# Altium project MACHINE_EMBBED_V1I2.PrjPcb (part 2 of 3)

## Sheet [05] - PROCESSOR 2 of 3, USB and SERIAL.SchDoc
size A2; DocumentNumber: 5; SheetNumber: 5; SheetTotal: 13; NameAuthor: Angle Vu
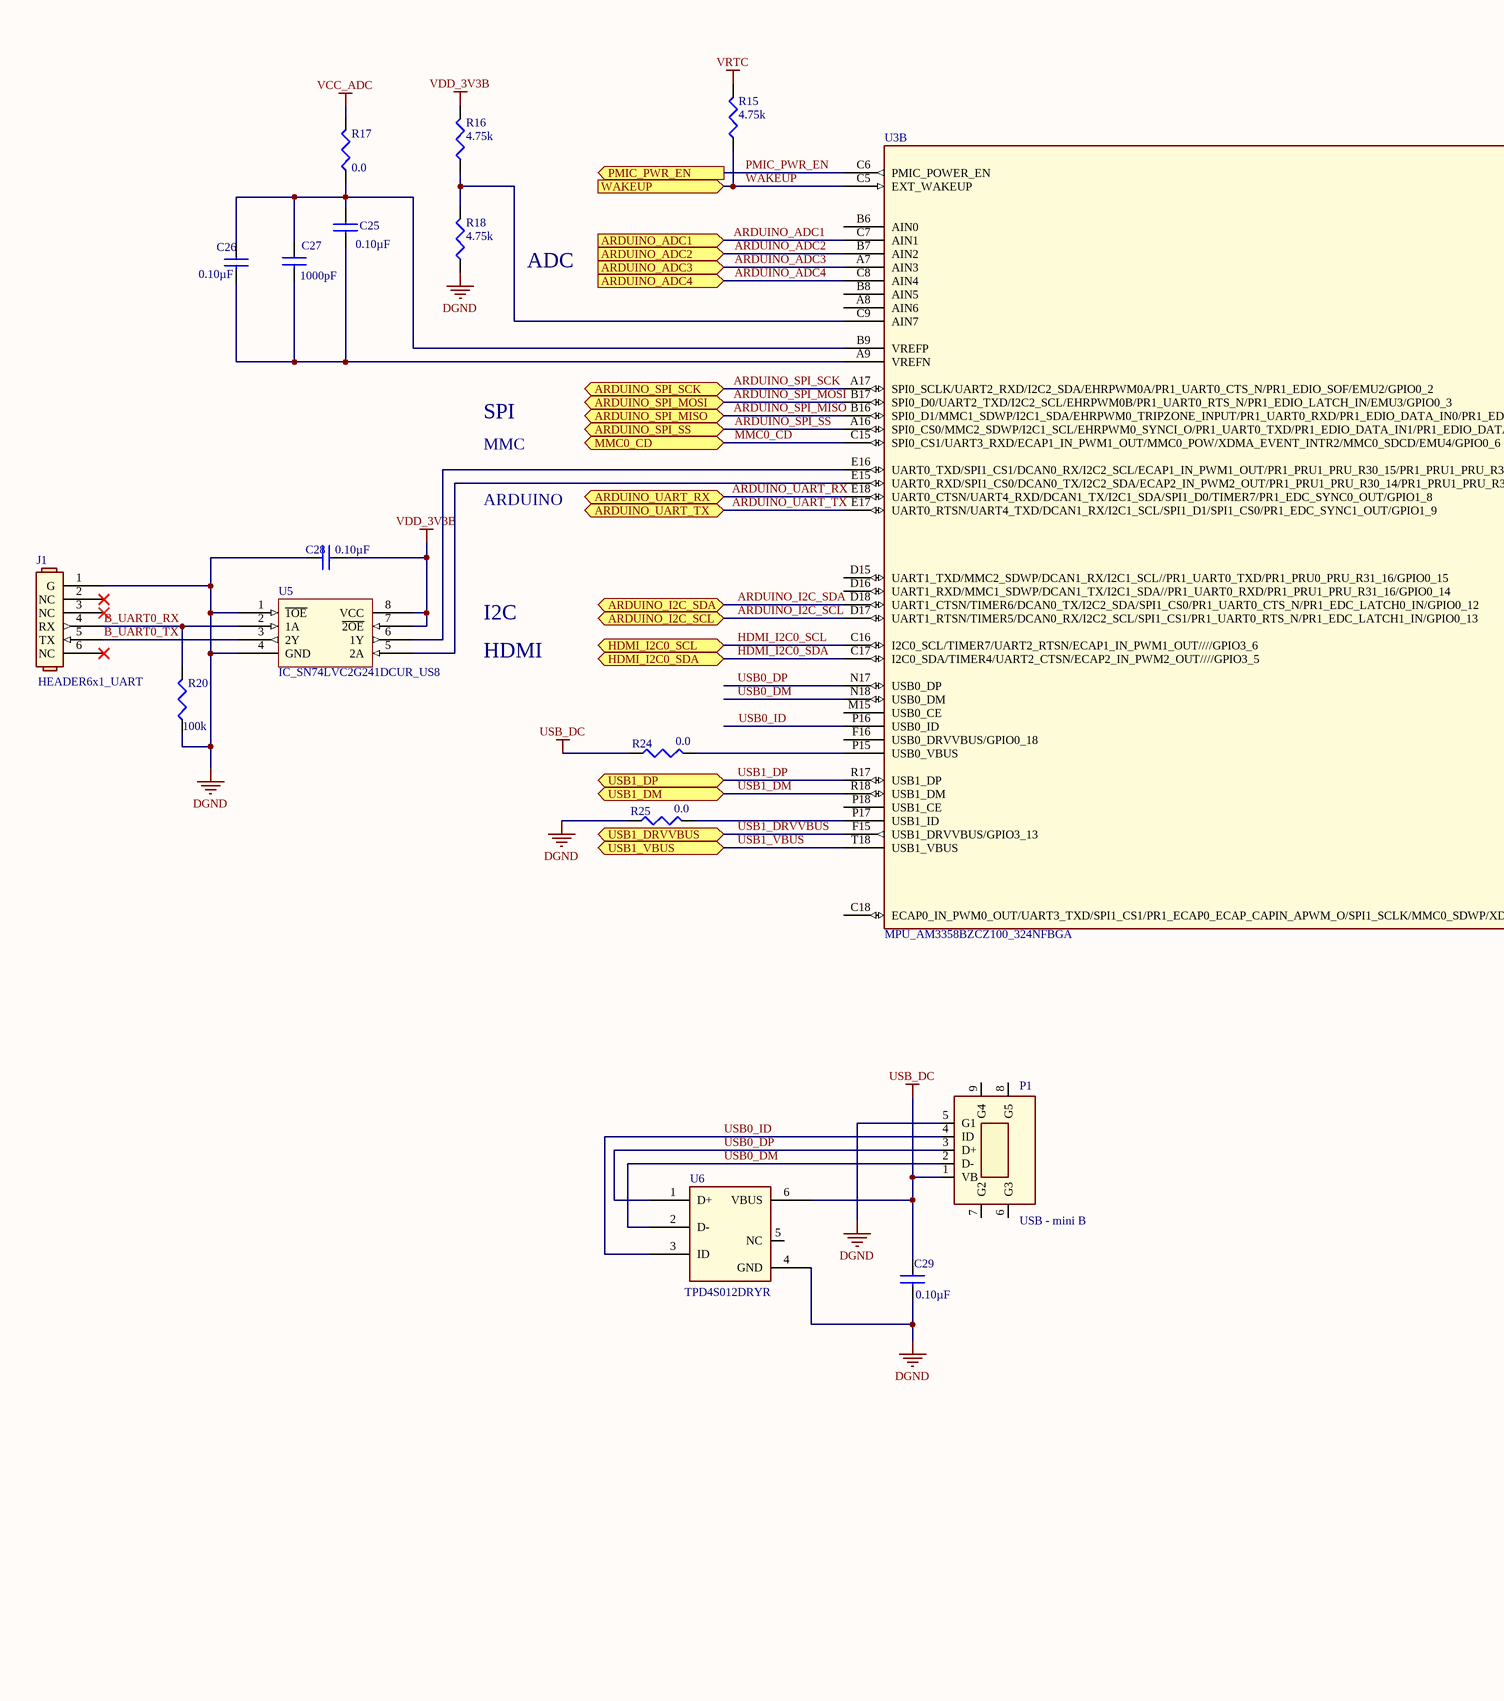
[diagram p5: [05] - PROCESSOR 2 of 3, USB and SERIAL.SchDoc, left]
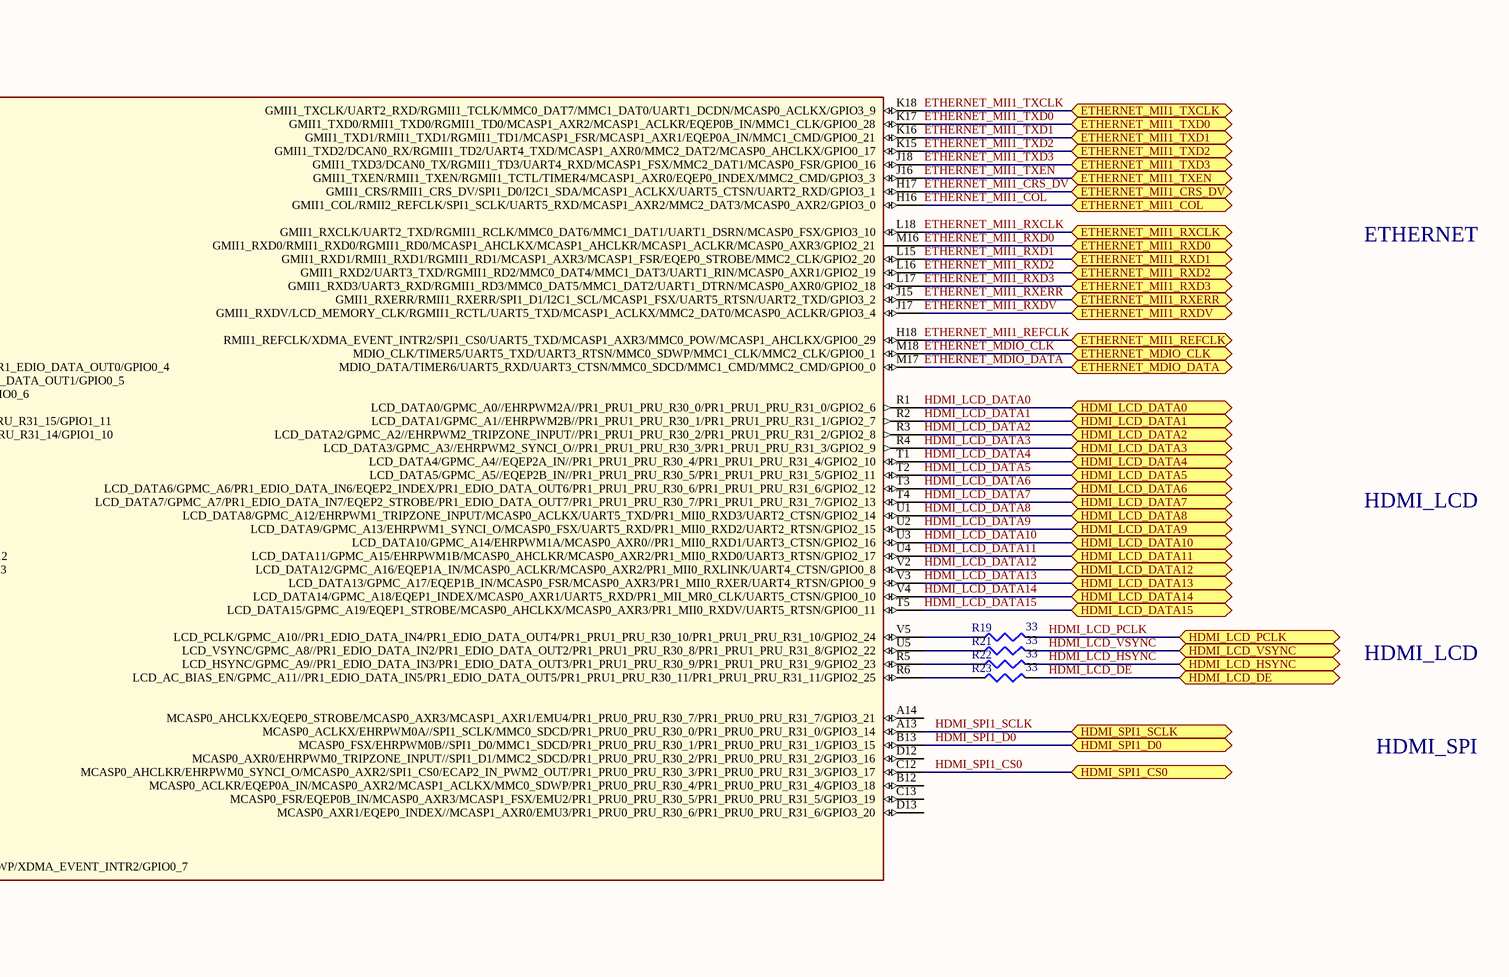
[diagram p6: [05] - PROCESSOR 2 of 3, USB and SERIAL.SchDoc, right]

### Parts
C25  Capacitance: 0.10µF  (hidden comment: C_CER_0.1uF_6.3V_X5R_0402_10%)
C26  Capacitance: 0.10µF  (hidden comment: C_CER_0.1uF_6.3V_X5R_0402_10%)
C27  Capacitance: 1000pF  (hidden comment: C_CER_1000pF_16V_X5R_0402_10%)
C28  Capacitance: 0.10µF  (hidden comment: C_CER_0.1uF_6.3V_X5R_0402_10%)
C29  Capacitance: 0.10µF  (hidden comment: C_CER_0.1uF_6.3V_X5R_0402_10%)
J1  HEADER6x1_UART
P1  Connector Type: USB - mini B  (hidden comment: PWR_MINI_USB_UX60SC-MB-5ST(80))
R15  Resistance (Ohms): 4.75k  (hidden comment: R_4.75K_1/16W_0402_1%)
R16  Resistance (Ohms): 4.75k  (hidden comment: R_4.75K_1/16W_0402_1%)
R17  Resistance (Ohms): 0.0  (hidden comment: R_0OhM_1/16W_0402)
R18  Resistance (Ohms): 4.75k  (hidden comment: R_4.75K_1/16W_0402_1%)
R19  Resistance (Ohms): 33  (hidden comment: R_33_1/16W_0402_5%)
R20  Resistance (Ohms): 100k  (hidden comment: R_100k_1/16W_0402_1%)
R21  Resistance (Ohms): 33  (hidden comment: R_33_1/16W_0402_5%)
R22  Resistance (Ohms): 33  (hidden comment: R_33_1/16W_0402_5%)
R23  Resistance (Ohms): 33  (hidden comment: R_33_1/16W_0402_5%)
R24  Resistance (Ohms): 0.0  (hidden comment: R_0OhM_1/16W_0402)
R25  Resistance (Ohms): 0.0  (hidden comment: R_0OhM_1/16W_0402)
U3  MPU_AM3358BZCZ100_324NFBGA  (part B of 3)
U5  IC_SN74LVC2G241DCUR_US8
U6  Manufacturer Part Number: TPD4S012DRYR  (hidden comment: IC_4CH_ESD_TPD4S012DRYR_6SON)

### Ports
ARDUINO_ADC1 (in), ARDUINO_ADC2 (in), ARDUINO_ADC3 (in), ARDUINO_ADC4 (in), ARDUINO_I2C_SCL (bidir), ARDUINO_I2C_SDA (bidir), ARDUINO_SPI_MISO (bidir), ARDUINO_SPI_MOSI (bidir), ARDUINO_SPI_SCK (bidir), ARDUINO_SPI_SS (bidir), ARDUINO_UART_RX (bidir), ARDUINO_UART_TX (bidir), ETHERNET_MDIO_CLK (bidir), ETHERNET_MDIO_DATA (bidir), ETHERNET_MII1_COL (bidir), ETHERNET_MII1_CRS_DV (bidir), ETHERNET_MII1_REFCLK (bidir), ETHERNET_MII1_RXCLK (bidir), ETHERNET_MII1_RXD0 (bidir), ETHERNET_MII1_RXD1 (bidir), ETHERNET_MII1_RXD2 (bidir), ETHERNET_MII1_RXD3 (bidir), ETHERNET_MII1_RXDV (bidir), ETHERNET_MII1_RXERR (bidir), ETHERNET_MII1_TXCLK (bidir), ETHERNET_MII1_TXD0 (bidir), ETHERNET_MII1_TXD1 (bidir), ETHERNET_MII1_TXD2 (bidir), ETHERNET_MII1_TXD3 (bidir), ETHERNET_MII1_TXEN (bidir), HDMI_I2C0_SCL (bidir), HDMI_I2C0_SDA (bidir), HDMI_LCD_DATA0 (bidir), HDMI_LCD_DATA1 (bidir), HDMI_LCD_DATA2 (bidir), HDMI_LCD_DATA3 (bidir), HDMI_LCD_DATA4 (bidir), HDMI_LCD_DATA5 (bidir), HDMI_LCD_DATA6 (bidir), HDMI_LCD_DATA7 (bidir), HDMI_LCD_DATA8 (bidir), HDMI_LCD_DATA9 (bidir), HDMI_LCD_DATA10 (bidir), HDMI_LCD_DATA11 (bidir), HDMI_LCD_DATA12 (bidir), HDMI_LCD_DATA13 (bidir), HDMI_LCD_DATA14 (bidir), HDMI_LCD_DATA15 (bidir), HDMI_LCD_DE (bidir), HDMI_LCD_HSYNC (bidir), HDMI_LCD_PCLK (bidir), HDMI_LCD_VSYNC (bidir), HDMI_SPI1_CS0 (bidir), HDMI_SPI1_D0 (bidir), HDMI_SPI1_SCLK (bidir), MMC0_CD (bidir), PMIC_PWR_EN (out), USB1_DM (bidir), USB1_DP (bidir), USB1_DRVVBUS (bidir), USB1_VBUS (bidir), WAKEUP (in)

### Nets
DGND: C28.1 C29.2 J1.1(G) P1.5(G1) R18.1 R20.1 R25.1 U5.1(~{1OE}) U5.4(GND) U6.4(GND)  [project net GND_OSC0]
USB_DC: C29.1 P1.1(VB) R24.1 U6.6(VBUS)
VCC_ADC: R17.2
VDD_3V3B: C28.2 R16.2 U5.7(~{2OE}) U5.8(VCC)
VRTC: R15.2
ARDUINO_ADC1: U3.C7(AIN1) ; port ARDUINO_ADC1
ARDUINO_ADC2: U3.B7(AIN2) ; port ARDUINO_ADC2
ARDUINO_ADC3: U3.A7(AIN3) ; port ARDUINO_ADC3
ARDUINO_ADC4: U3.C8(AIN4) ; port ARDUINO_ADC4
ARDUINO_I2C_SCL: U3.D17(UART1_RTSN/TIMER5/DCAN0_RX/I2C2_SCL/SPI1_CS1/PR1_UART0_RTS_N/PR1_EDC_LATCH1_IN/GPIO0_13) ; port ARDUINO_I2C_SCL
ARDUINO_I2C_SDA: U3.D18(UART1_CTSN/TIMER6/DCAN0_TX/I2C2_SDA/SPI1_CS0/PR1_UART0_CTS_N/PR1_EDC_LATCH0_IN/GPIO0_12) ; port ARDUINO_I2C_SDA
ARDUINO_SPI_MISO: U3.B16(SPI0_D1/MMC1_SDWP/I2C1_SDA/EHRPWM0_TRIPZONE_INPUT/PR1_UART0_RXD/PR1_EDIO_DATA_IN0/PR1_EDIO_DATA_OUT0/GPIO0_4) ; port ARDUINO_SPI_MISO
ARDUINO_SPI_MOSI: U3.B17(SPI0_D0/UART2_TXD/I2C2_SCL/EHRPWM0B/PR1_UART0_RTS_N/PR1_EDIO_LATCH_IN/EMU3/GPIO0_3) ; port ARDUINO_SPI_MOSI
ARDUINO_SPI_SCK: U3.A17(SPI0_SCLK/UART2_RXD/I2C2_SDA/EHRPWM0A/PR1_UART0_CTS_N/PR1_EDIO_SOF/EMU2/GPIO0_2) ; port ARDUINO_SPI_SCK
ARDUINO_SPI_SS: U3.A16(SPI0_CS0/MMC2_SDWP/I2C1_SCL/EHRPWM0_SYNCI_O/PR1_UART0_TXD/PR1_EDIO_DATA_IN1/PR1_EDIO_DATA_OUT1/GPIO0_5) ; port ARDUINO_SPI_SS
ARDUINO_UART_RX: U3.E18(UART0_CTSN/UART4_RXD/DCAN1_TX/I2C1_SDA/SPI1_D0/TIMER7/PR1_EDC_SYNC0_OUT/GPIO1_8) ; port ARDUINO_UART_RX
ARDUINO_UART_TX: U3.E17(UART0_RTSN/UART4_TXD/DCAN1_RX/I2C1_SCL/SPI1_D1/SPI1_CS0/PR1_EDC_SYNC1_OUT/GPIO1_9) ; port ARDUINO_UART_TX
B_UART0_RX: J1.4(RX) R20.2 U5.2(1A)
B_UART0_TX: J1.5(TX) U5.3(2Y)
ETHERNET_MDIO_CLK: U3.M18(MDIO_CLK/TIMER5/UART5_TXD/UART3_RTSN/MMC0_SDWP/MMC1_CLK/MMC2_CLK/GPIO0_1) ; port ETHERNET_MDIO_CLK
ETHERNET_MDIO_DATA: U3.M17(MDIO_DATA/TIMER6/UART5_RXD/UART3_CTSN/MMC0_SDCD/MMC1_CMD/MMC2_CMD/GPIO0_0) ; port ETHERNET_MDIO_DATA
ETHERNET_MII1_COL: U3.H16(GMII1_COL/RMII2_REFCLK/SPI1_SCLK/UART5_RXD/MCASP1_AXR2/MMC2_DAT3/MCASP0_AXR2/GPIO3_0) ; port ETHERNET_MII1_COL
ETHERNET_MII1_CRS_DV: U3.H17(GMII1_CRS/RMII1_CRS_DV/SPI1_D0/I2C1_SDA/MCASP1_ACLKX/UART5_CTSN/UART2_RXD/GPIO3_1) ; port ETHERNET_MII1_CRS_DV
ETHERNET_MII1_REFCLK: U3.H18(RMII1_REFCLK/XDMA_EVENT_INTR2/SPI1_CS0/UART5_TXD/MCASP1_AXR3/MMC0_POW/MCASP1_AHCLKX/GPIO0_29) ; port ETHERNET_MII1_REFCLK
ETHERNET_MII1_RXCLK: U3.L18(GMII1_RXCLK/UART2_TXD/RGMII1_RCLK/MMC0_DAT6/MMC1_DAT1/UART1_DSRN/MCASP0_FSX/GPIO3_10) ; port ETHERNET_MII1_RXCLK
ETHERNET_MII1_RXD0: U3.M16(GMII1_RXD0/RMII1_RXD0/RGMII1_RD0/MCASP1_AHCLKX/MCASP1_AHCLKR/MCASP1_ACLKR/MCASP0_AXR3/GPIO2_21) ; port ETHERNET_MII1_RXD0
ETHERNET_MII1_RXD1: U3.L15(GMII1_RXD1/RMII1_RXD1/RGMII1_RD1/MCASP1_AXR3/MCASP1_FSR/EQEP0_STROBE/MMC2_CLK/GPIO2_20) ; port ETHERNET_MII1_RXD1
ETHERNET_MII1_RXD2: U3.L16(GMII1_RXD2/UART3_TXD/RGMII1_RD2/MMC0_DAT4/MMC1_DAT3/UART1_RIN/MCASP0_AXR1/GPIO2_19) ; port ETHERNET_MII1_RXD2
ETHERNET_MII1_RXD3: U3.L17(GMII1_RXD3/UART3_RXD/RGMII1_RD3/MMC0_DAT5/MMC1_DAT2/UART1_DTRN/MCASP0_AXR0/GPIO2_18) ; port ETHERNET_MII1_RXD3
ETHERNET_MII1_RXDV: U3.J17(GMII1_RXDV/LCD_MEMORY_CLK/RGMII1_RCTL/UART5_TXD/MCASP1_ACLKX/MMC2_DAT0/MCASP0_ACLKR/GPIO3_4) ; port ETHERNET_MII1_RXDV
ETHERNET_MII1_RXERR: U3.J15(GMII1_RXERR/RMII1_RXERR/SPI1_D1/I2C1_SCL/MCASP1_FSX/UART5_RTSN/UART2_TXD/GPIO3_2) ; port ETHERNET_MII1_RXERR
ETHERNET_MII1_TXCLK: U3.K18(GMII1_TXCLK/UART2_RXD/RGMII1_TCLK/MMC0_DAT7/MMC1_DAT0/UART1_DCDN/MCASP0_ACLKX/GPIO3_9) ; port ETHERNET_MII1_TXCLK
ETHERNET_MII1_TXD0: U3.K17(GMII1_TXD0/RMII1_TXD0/RGMII1_TD0/MCASP1_AXR2/MCASP1_ACLKR/EQEP0B_IN/MMC1_CLK/GPIO0_28) ; port ETHERNET_MII1_TXD0
ETHERNET_MII1_TXD1: U3.K16(GMII1_TXD1/RMII1_TXD1/RGMII1_TD1/MCASP1_FSR/MCASP1_AXR1/EQEP0A_IN/MMC1_CMD/GPIO0_21) ; port ETHERNET_MII1_TXD1
ETHERNET_MII1_TXD2: U3.K15(GMII1_TXD2/DCAN0_RX/RGMII1_TD2/UART4_TXD/MCASP1_AXR0/MMC2_DAT2/MCASP0_AHCLKX/GPIO0_17) ; port ETHERNET_MII1_TXD2
ETHERNET_MII1_TXD3: U3.J18(GMII1_TXD3/DCAN0_TX/RGMII1_TD3/UART4_RXD/MCASP1_FSX/MMC2_DAT1/MCASP0_FSR/GPIO0_16) ; port ETHERNET_MII1_TXD3
ETHERNET_MII1_TXEN: U3.J16(GMII1_TXEN/RMII1_TXEN/RGMII1_TCTL/TIMER4/MCASP1_AXR0/EQEP0_INDEX/MMC2_CMD/GPIO3_3) ; port ETHERNET_MII1_TXEN
HDMI_I2C0_SCL: U3.C16(I2C0_SCL/TIMER7/UART2_RTSN/ECAP1_IN_PWM1_OUT////GPIO3_6) ; port HDMI_I2C0_SCL
HDMI_I2C0_SDA: U3.C17(I2C0_SDA/TIMER4/UART2_CTSN/ECAP2_IN_PWM2_OUT////GPIO3_5) ; port HDMI_I2C0_SDA
HDMI_LCD_DATA0: U3.R1(LCD_DATA0/GPMC_A0//EHRPWM2A//PR1_PRU1_PRU_R30_0/PR1_PRU1_PRU_R31_0/GPIO2_6) ; port HDMI_LCD_DATA0
HDMI_LCD_DATA1: U3.R2(LCD_DATA1/GPMC_A1//EHRPWM2B//PR1_PRU1_PRU_R30_1/PR1_PRU1_PRU_R31_1/GPIO2_7) ; port HDMI_LCD_DATA1
HDMI_LCD_DATA2: U3.R3(LCD_DATA2/GPMC_A2//EHRPWM2_TRIPZONE_INPUT//PR1_PRU1_PRU_R30_2/PR1_PRU1_PRU_R31_2/GPIO2_8) ; port HDMI_LCD_DATA2
HDMI_LCD_DATA3: U3.R4(LCD_DATA3/GPMC_A3//EHRPWM2_SYNCI_O//PR1_PRU1_PRU_R30_3/PR1_PRU1_PRU_R31_3/GPIO2_9) ; port HDMI_LCD_DATA3
HDMI_LCD_DATA4: U3.T1(LCD_DATA4/GPMC_A4//EQEP2A_IN//PR1_PRU1_PRU_R30_4/PR1_PRU1_PRU_R31_4/GPIO2_10) ; port HDMI_LCD_DATA4
HDMI_LCD_DATA5: U3.T2(LCD_DATA5/GPMC_A5//EQEP2B_IN//PR1_PRU1_PRU_R30_5/PR1_PRU1_PRU_R31_5/GPIO2_11) ; port HDMI_LCD_DATA5
HDMI_LCD_DATA6: U3.T3(LCD_DATA6/GPMC_A6/PR1_EDIO_DATA_IN6/EQEP2_INDEX/PR1_EDIO_DATA_OUT6/PR1_PRU1_PRU_R30_6/PR1_PRU1_PRU_R31_6/GPIO2_12) ; port HDMI_LCD_DATA6
HDMI_LCD_DATA7: U3.T4(LCD_DATA7/GPMC_A7/PR1_EDIO_DATA_IN7/EQEP2_STROBE/PR1_EDIO_DATA_OUT7/PR1_PRU1_PRU_R30_7/PR1_PRU1_PRU_R31_7/GPIO2_13) ; port HDMI_LCD_DATA7
HDMI_LCD_DATA8: U3.U1(LCD_DATA8/GPMC_A12/EHRPWM1_TRIPZONE_INPUT/MCASP0_ACLKX/UART5_TXD/PR1_MII0_RXD3/UART2_CTSN/GPIO2_14) ; port HDMI_LCD_DATA8
HDMI_LCD_DATA9: U3.U2(LCD_DATA9/GPMC_A13/EHRPWM1_SYNCI_O/MCASP0_FSX/UART5_RXD/PR1_MII0_RXD2/UART2_RTSN/GPIO2_15) ; port HDMI_LCD_DATA9
HDMI_LCD_DATA10: U3.U3(LCD_DATA10/GPMC_A14/EHRPWM1A/MCASP0_AXR0//PR1_MII0_RXD1/UART3_CTSN/GPIO2_16) ; port HDMI_LCD_DATA10
HDMI_LCD_DATA11: U3.U4(LCD_DATA11/GPMC_A15/EHRPWM1B/MCASP0_AHCLKR/MCASP0_AXR2/PR1_MII0_RXD0/UART3_RTSN/GPIO2_17) ; port HDMI_LCD_DATA11
HDMI_LCD_DATA12: U3.V2(LCD_DATA12/GPMC_A16/EQEP1A_IN/MCASP0_ACLKR/MCASP0_AXR2/PR1_MII0_RXLINK/UART4_CTSN/GPIO0_8) ; port HDMI_LCD_DATA12
HDMI_LCD_DATA13: U3.V3(LCD_DATA13/GPMC_A17/EQEP1B_IN/MCASP0_FSR/MCASP0_AXR3/PR1_MII0_RXER/UART4_RTSN/GPIO0_9) ; port HDMI_LCD_DATA13
HDMI_LCD_DATA14: U3.V4(LCD_DATA14/GPMC_A18/EQEP1_INDEX/MCASP0_AXR1/UART5_RXD/PR1_MII_MR0_CLK/UART5_CTSN/GPIO0_10) ; port HDMI_LCD_DATA14
HDMI_LCD_DATA15: U3.T5(LCD_DATA15/GPMC_A19/EQEP1_STROBE/MCASP0_AHCLKX/MCASP0_AXR3/PR1_MII0_RXDV/UART5_RTSN/GPIO0_11) ; port HDMI_LCD_DATA15
HDMI_LCD_DE: R23.2 ; port HDMI_LCD_DE
HDMI_LCD_HSYNC: R22.2 ; port HDMI_LCD_HSYNC
HDMI_LCD_PCLK: R19.2 ; port HDMI_LCD_PCLK
HDMI_LCD_VSYNC: R21.2 ; port HDMI_LCD_VSYNC
HDMI_SPI1_CS0: U3.C12(MCASP0_AHCLKR/EHRPWM0_SYNCI_O/MCASP0_AXR2/SPI1_CS0/ECAP2_IN_PWM2_OUT/PR1_PRU0_PRU_R30_3/PR1_PRU0_PRU_R31_3/GPIO3_17) ; port HDMI_SPI1_CS0
HDMI_SPI1_D0: U3.B13(MCASP0_FSX/EHRPWM0B//SPI1_D0/MMC1_SDCD/PR1_PRU0_PRU_R30_1/PR1_PRU0_PRU_R31_1/GPIO3_15) ; port HDMI_SPI1_D0
HDMI_SPI1_SCLK: U3.A13(MCASP0_ACLKX/EHRPWM0A//SPI1_SCLK/MMC0_SDCD/PR1_PRU0_PRU_R30_0/PR1_PRU0_PRU_R31_0/GPIO3_14) ; port HDMI_SPI1_SCLK
MMC0_CD: U3.C15(SPI0_CS1/UART3_RXD/ECAP1_IN_PWM1_OUT/MMC0_POW/XDMA_EVENT_INTR2/MMC0_SDCD/EMU4/GPIO0_6) ; port MMC0_CD
PMIC_PWR_EN: U3.C6(PMIC_POWER_EN) ; port PMIC_PWR_EN
USB0_DM: P1.2(D-) U3.N18(USB0_DM) U6.2(D-)
USB0_DP: P1.3(D+) U3.N17(USB0_DP) U6.1(D+)
USB0_ID: P1.4(ID) U3.P16(USB0_ID) U6.3(ID)
USB1_DM: U3.R18(USB1_DM) ; port USB1_DM
USB1_DP: U3.R17(USB1_DP) ; port USB1_DP
USB1_DRVVBUS: U3.F15(USB1_DRVVBUS/GPIO3_13) ; port USB1_DRVVBUS
USB1_VBUS: U3.T18(USB1_VBUS) ; port USB1_VBUS
WAKEUP: R15.1 U3.C5(EXT_WAKEUP) ; port WAKEUP
NetC25_1: C25.1 C26.1 C27.1 R17.1 U3.B9(VREFP)
NetC25_2: C25.2 C26.2 C27.2 U3.A9(VREFN)
NetR16_1: R16.1 R18.2 U3.C9(AIN7)
NetR19_1: R19.1 U3.V5(LCD_PCLK/GPMC_A10//PR1_EDIO_DATA_IN4/PR1_EDIO_DATA_OUT4/PR1_PRU1_PRU_R30_10/PR1_PRU1_PRU_R31_10/GPIO2_24)
NetR21_1: R21.1 U3.U5(LCD_VSYNC/GPMC_A8//PR1_EDIO_DATA_IN2/PR1_EDIO_DATA_OUT2/PR1_PRU1_PRU_R30_8/PR1_PRU1_PRU_R31_8/GPIO2_22)
NetR22_1: R22.1 U3.R5(LCD_HSYNC/GPMC_A9//PR1_EDIO_DATA_IN3/PR1_EDIO_DATA_OUT3/PR1_PRU1_PRU_R30_9/PR1_PRU1_PRU_R31_9/GPIO2_23)
NetR23_1: R23.1 U3.R6(LCD_AC_BIAS_EN/GPMC_A11//PR1_EDIO_DATA_IN5/PR1_EDIO_DATA_OUT5/PR1_PRU1_PRU_R30_11/PR1_PRU1_PRU_R31_11/GPIO2_25)
NetR24_2: R24.2 U3.P15(USB0_VBUS)
NetR25_2: R25.2 U3.P17(USB1_ID)
NetU3_E15: U3.E15(UART0_RXD/SPI1_CS0/DCAN0_TX/I2C2_SDA/ECAP2_IN_PWM2_OUT/PR1_PRU1_PRU_R30_14/PR1_PRU1_PRU_R31_14/GPIO1_10) U5.5(2A)
NetU3_E16: U3.E16(UART0_TXD/SPI1_CS1/DCAN0_RX/I2C2_SCL/ECAP1_IN_PWM1_OUT/PR1_PRU1_PRU_R30_15/PR1_PRU1_PRU_R31_15/GPIO1_11) U5.6(1Y)

Not connected (* = marked no-connect by the designer): J1 2(NC)* 3(NC)* 6(NC)*; P1 6(G3) 7(G2) 8(G5) 9(G4); U3 A8(AIN6) A14(MCASP0_AHCLKX/EQEP0_STROBE/MCASP0_AXR3/MCASP1_AXR1/EMU4/PR1_PRU0_PRU_R30_7/PR1_PRU0_PRU_R31_7/GPIO3_21) B6(AIN0) B8(AIN5) B12(MCASP0_ACLKR/EQEP0A_IN/MCASP0_AXR2/MCASP1_ACLKX/MMC0_SDWP/PR1_PRU0_PRU_R30_4/PR1_PRU0_PRU_R31_4/GPIO3_18) C13(MCASP0_FSR/EQEP0B_IN/MCASP0_AXR3/MCASP1_FSX/EMU2/PR1_PRU0_PRU_R30_5/PR1_PRU0_PRU_R31_5/GPIO3_19) C18(ECAP0_IN_PWM0_OUT/UART3_TXD/SPI1_CS1/PR1_ECAP0_ECAP_CAPIN_APWM_O/SPI1_SCLK/MMC0_SDWP/XDMA_EVENT_INTR2/GPIO0_7) D12(MCASP0_AXR0/EHRPWM0_TRIPZONE_INPUT//SPI1_D1/MMC2_SDCD/PR1_PRU0_PRU_R30_2/PR1_PRU0_PRU_R31_2/GPIO3_16) D13(MCASP0_AXR1/EQEP0_INDEX//MCASP1_AXR0/EMU3/PR1_PRU0_PRU_R30_6/PR1_PRU0_PRU_R31_6/GPIO3_20) D15(UART1_TXD/MMC2_SDWP/DCAN1_RX/I2C1_SCL//PR1_UART0_TXD/PR1_PRU0_PRU_R31_16/GPIO0_15) D16(UART1_RXD/MMC1_SDWP/DCAN1_TX/I2C1_SDA//PR1_UART0_RXD/PR1_PRU1_PRU_R31_16/GPIO0_14) F16(USB0_DRVVBUS/GPIO0_18) M15(USB0_CE) P18(USB1_CE); U6 5(NC)

### Notes on the sheet
- ADC
- ETHERNET
- SPI
- MMC
- ARDUINO
- HDMI_LCD
- I2C
- HDMI
- HDMI_SPI
- CLOCKS (CPU & PCIE)
- Designed By
- Checked By
- Page Name:
- Size:
- A2
- Company:
- Address:
- Sheet:
- /
- (in symbol BeagleBoard_org) Title; Size; Document Number; Rev; Date:; Sheet; of
- (in symbol CONN_54819-0578_2) VBUS; SHIELD; D-; D+; GND

### Library data of the parts
C25 C26 C28 C29 = C_CER_0.1uF_6.3V_X5R_0402_10%: CAP CER 0.1UF 6.3V X5R 0402; Manufacturer: Murata Electronics North America; Manufacturer Part Number: GRM155R60J104KA01D; Tolerance: ±10%; Supplier 1: Digi-Key; RoHS: RoHS Compliant; Category: Capacitors; Stock 1: 370000; Pricing 1: 10000=0.0021, 20000=0.002, 30000=0.0019, 50000=0.0017, 100000=0.00138 (USD); Packaging: Tape & Reel (TR); Part Status: Active; Voltage - Rated: 6.3V; Temperature Coefficient: X5R; Operating Temperature: -55°C ~ 85°C; Features: -; Ratings: -; Applications: General Purpose; Failure Rate: *; Mounting Type: Surface Mount, MLCC; Package / Case: 0402 (1005 Metric); Size / Dimension: 0.039" L x 0.020" W (1.00mm x 0.50mm); Height - Seated (Max): -; Thickness (Max): 0.022" (0.55mm); Lead Spacing: -; Lead Style: -; ComponentLink1URL: http://www.murata.com/~/media/webrenewal/support/library/catalog/products/capacitor/mlcc/c02e.pdf; ComponentLink1Description: http://www.murata.com/~/media/webrenewal/support/library/catalog/products/capacitor/mlcc/c02e.pdf; Supplier Part Number 1: 490-6287-2-ND
C27 = C_CER_1000pF_16V_X5R_0402_10%: CAP CER 1000PF 16V X5R 0402; Manufacturer: Murata Electronics North America; Manufacturer Part Number: GRM155R61C102KA01D; Tolerance: ±10%; Supplier 1: Digi-Key; RoHS: RoHS Compliant; Category: Capacitors; Stock 1: 39732; Pricing 1: 1=0.1, 10=0.023, 50=0.0124, 100=0.0105, 250=0.00856, 500=0.00732, 1000=0.0057, 5000=0.00475 (USD); Packaging: Cut Tape (CT); Part Status: Active; Voltage - Rated: 16V; Temperature Coefficient: X5R; Operating Temperature: -55°C ~ 85°C; Features: -; Ratings: -; Applications: General Purpose; Failure Rate: *; Mounting Type: Surface Mount, MLCC; Package / Case: 0402 (1005 Metric); Size / Dimension: 0.039" L x 0.020" W (1.00mm x 0.50mm); Height - Seated (Max): -; Thickness (Max): 0.022" (0.55mm); Lead Spacing: -; Lead Style: *; ComponentLink1URL: http://www.murata.com/~/media/webrenewal/support/library/catalog/products/capacitor/mlcc/c02e.pdf; ComponentLink1Description: http://www.murata.com/~/media/webrenewal/support/library/catalog/products/capacitor/mlcc/c02e.pdf; Supplier Part Number 1: 490-6308-1-ND
J1 = HEADER6x1_MALE_HOLE100: CONN HEADER 6POS .100 STR TIN; Manufacturer: Amphenol FCI; Manufacturer Part Number: 68000-406HLF; Connector Type: Header, Unshrouded; Number of Positions: 6; Number of Positions Loaded: All; Pitch: 0.100" (2.54mm); Supplier 1: Digi-Key; RoHS: RoHS Compliant; Category: Connectors, Interconnects; Stock 1: 39050; Pricing 1: 1=0.25, 10=0.233, 25=0.1988, 100=0.1615, 250=0.14284, 500=0.13662, 1000=0.11178, 2500=0.10246, 5000=0.09936 (USD); Packaging: Bulk; Part Status: Active; Contact Type: Male Pin; Number of Rows: 1; Row Spacing: -; Contact Mating Length: 0.230" (5.84mm); Mounting Type: Through Hole; Termination: Solder; Fastening Type: -; Features: -; Contact Finish: Tin; Contact Finish Thickness: 100µin (2.54µm); Color: Black; ComponentLink1URL: http://portal.fciconnect.com/Comergent//fci/drawing/68000.pdf; ComponentLink1Description: http://portal.fciconnect.com/Comergent//fci/drawing/68000.pdf; Supplier Part Number 1: 609-3263-ND
P1 = PWR_MINI_USB_UX60SC-MB-5ST(80): CONN RCPT USB MINI B R/A SMD; Manufacturer: Hirose Electric Co Ltd; Number of Contacts: 5; Gender: Receptacle; Specifications: USB 2.0; Supplier 1: Digi-Key; Manufacturer Part Number: UX60SC-MB-5ST(80); RoHS: RoHS Compliant; Category: Connectors, Interconnects; Stock 1: 33000; Pricing 1: 1500=0.375, 3000=0.3625, 7500=0.35, 10500=0.3325, 15000=0.325 (USD); Packaging: Tape & Reel (TR); Part Status: Active; Mounting Type: Surface Mount, Right Angle, Horizontal; Features: Solder Retention; Ingress Protection: -; ComponentLink1URL: http://media.digikey.com/pdf/Data%20Sheets/Hirose%20PDFs/UX60S.pdf; ComponentLink1Description: http://media.digikey.com/pdf/Data%20Sheets/Hirose%20PDFs/UX60S.pdf; Supplier Part Number 1: H11671TR-ND
R15 R16 R18 = R_4.75K_1/16W_0402_1%: RES SMD 4.75K OHM 1% 1/16W 0402; Manufacturer: Vishay Dale; Manufacturer Part Number: CRCW04024K75FKED; Power (Watts): 0.063W, 1/16W; Temperature Coefficient: ±100ppm/°C; Supplier 1: Digi-Key; RoHS: RoHS Compliant; Category: Resistors; Stock 1: 360000; Pricing 1: 10000=0.0033, 30000=0.0029, 50000=0.00266, 100000=0.00261 (USD); Packaging: Tape & Reel (TR); Part Status: Active; Tolerance: ±1%; Composition: Thick Film; Features: Automotive AEC-Q200; Operating Temperature: -55°C ~ 155°C; Package / Case: 0402 (1005 Metric); Supplier Device Package: 0402; Size / Dimension: 0.039" L x 0.020" W (1.00mm x 0.50mm); Height: 0.016" (0.40mm); Number of Terminations: 2; Failure Rate: -; ComponentLink1URL: http://www.vishay.com/docs/20035/dcrcwe3.pdf; ComponentLink1Description: http://www.vishay.com/docs/20035/dcrcwe3.pdf; Supplier Part Number 1: 541-4.75KLTR-ND
R17 R24 R25 = R_0OhM_1/16W_0402: RES SMD 0.0OHM JUMPER 1/16W 0402; Manufacturer: Yageo; Manufacturer Part Number: RC0402JR-070RL; Power (Watts): 0.063W, 1/16W; Supplier 1: Digi-Key; RoHS: RoHS Compliant; Category: Resistors; Stock 1: 13978228; Pricing 1: 1=0.1, 10=0.013, 25=0.0092, 100=0.0053, 250=0.004, 500=0.0032, 1000=0.00236, 2500=0.00205, 5000=0.00169 (USD); Packaging: Cut Tape (CT); Part Status: Active; Tolerance: Jumper; Composition: Thick Film; Features: Moisture Resistant; Temperature Coefficient: -; Operating Temperature: -55°C ~ 155°C; Package / Case: 0402 (1005 Metric); Supplier Device Package: 0402; Size / Dimension: 0.039" L x 0.020" W (1.00mm x 0.50mm); Height: 0.016" (0.40mm); Number of Terminations: 2; Failure Rate: -; ComponentLink1URL: http://www.yageo.com/documents/recent/PYu-RC_Group_51_RoHS_L_04.pdf; ComponentLink1Description: http://www.yageo.com/documents/recent/PYu-RC_Group_51_RoHS_L_04.pdf; Supplier Part Number 1: 311-0.0JRCT-ND
R19 R21-R23 = R_33_1/16W_0402_5%: RES SMD 33 OHM 5% 1/16W 0402; Manufacturer: Yageo; Manufacturer Part Number: RC0402JR-0733RL; Power (Watts): 0.063W, 1/16W; Temperature Coefficient: ±100ppm/°C; Supplier 1: Digi-Key; RoHS: RoHS Compliant; Category: Resistors; Stock 1: 1941028; Pricing 1: 1=0.1, 10=0.012, 25=0.0084, 100=0.0047, 250=0.0036, 500=0.0029, 1000=0.00213, 2500=0.00185, 5000=0.00153 (USD); Packaging: Cut Tape (CT); Part Status: Active; Tolerance: ±5%; Composition: Thick Film; Features: Moisture Resistant; Operating Temperature: -55°C ~ 155°C; Package / Case: 0402 (1005 Metric); Supplier Device Package: 0402; Size / Dimension: 0.039" L x 0.020" W (1.00mm x 0.50mm); Height: 0.016" (0.40mm); Number of Terminations: 2; Failure Rate: -; ComponentLink1URL: http://www.yageo.com/documents/recent/PYu-RC_Group_51_RoHS_L_04.pdf; ComponentLink1Description: http://www.yageo.com/documents/recent/PYu-RC_Group_51_RoHS_L_04.pdf; Supplier Part Number 1: 311-33JRCT-ND
R20 = R_100k_1/16W_0402_1%: RES SMD 100K OHM 1% 1/16W 0402; Manufacturer: Vishay Dale; Manufacturer Part Number: CRCW0402100KFKED; Power (Watts): 0.063W, 1/16W; Temperature Coefficient: ±100ppm/°C; Supplier 1: Digi-Key; RoHS: RoHS Compliant; Category: Resistors; Stock 1: 1287000; Pricing 1: 10000=0.0033, 30000=0.0029, 50000=0.00266, 100000=0.00261 (USD); Packaging: Tape & Reel (TR); Part Status: Active; Tolerance: ±1%; Composition: Thick Film; Features: Automotive AEC-Q200; Operating Temperature: -55°C ~ 155°C; Package / Case: 0402 (1005 Metric); Supplier Device Package: 0402; Size / Dimension: 0.039" L x 0.020" W (1.00mm x 0.50mm); Height: 0.016" (0.40mm); Number of Terminations: 2; Failure Rate: -; ComponentLink1URL: http://www.vishay.com/docs/20035/dcrcwe3.pdf; ComponentLink1Description: http://www.vishay.com/docs/20035/dcrcwe3.pdf; Supplier Part Number 1: 541-100KLTR-ND
U3 = MPU_AM3358BZCZ100_324NFBGA: IC MPU SITARA 1.0GHZ 324NFBGA; Manufacturer: Texas Instruments; Core Processor: ARM® Cortex®-A8; Number of Cores/Bus Width: 1 Core, 32-Bit; Co-Processors/DSP: Multimedia; NEON™ SIMD; RAM Controllers: LPDDR, DDR2, DDR3, DDR3L; Graphics Acceleration: Yes; Display & Interface Controllers: LCD, Touchscreen; Ethernet: 10/100/1000 Mbps (2); USB: USB 2.0 + PHY (2); Voltage - I/O: 1.8V, 3.3V; Security Features: Cryptography, Random Number Generator; Additional Interfaces: CAN, I²C, McASP, McSPI, MMC/SD/SDIO, UART; Supplier 1: Digi-Key; Manufacturer Part Number: AM3358BZCZ100; RoHS: RoHS Compliant; Category: Integrated Circuits (ICs); Stock 1: 6211; Pricing 1: 1=19.56, 10=17.978, 100=15.1835, 500=13.50676, 1000=12.38895, 2500=11.9232, 5000=11.64375 (USD); Packaging: Tube; Part Status: Active; Speed: 1.0GHz; SATA: -; Operating Temperature: 0°C ~ 90°C (TJ); Package / Case: 324-LFBGA; Supplier Device Package: 324-NFBGA(15x15); ComponentLink1URL: http://www.ti.com/lit/ds/symlink/am3352.pdf; ComponentLink1Description: http://www.ti.com/lit/ds/symlink/am3352.pdf; Supplier Part Number 1: 296-35869-5-ND
U5 = IC_SN74LVC2G241DCUR_US8: IC BUFF/DVR TRI-ST DL US8; Manufacturer: Texas Instruments; Logic Type: Buffer, Non-Inverting; Number of Elements: 2; Number of Bits per Element: 1; Output Type: Push-Pull; Current - Output High, Low: 32mA, 32mA; Voltage - Supply: 1.65 V ~ 5.5 V; Supplier 1: Digi-Key; Manufacturer Part Number: SN74LVC2G241DCUR; RoHS: RoHS Compliant; Category: Integrated Circuits (ICs); Stock 1: 30000; Pricing 1: 3000=0.2015, 6000=0.1885, 15000=0.1755, 30000=0.1664, 75000=0.1625 (USD); Packaging: Tape & Reel (TR); Part Status: Active; Input Type: -; Operating Temperature: -40°C ~ 125°C (TA); Mounting Type: Surface Mount; Package / Case: 8-VFSOP (0.091", 2.30mm Width); Supplier Device Package: US8; ComponentLink1URL: http://www.ti.com/lit/ds/symlink/sn74lvc2g241.pdf; ComponentLink1Description: http://www.ti.com/lit/ds/symlink/sn74lvc2g241.pdf; Supplier Part Number 1: 296-11936-2-ND
U6 = IC_4CH_ESD_TPD4S012DRYR_6SON: IC 4CH ESD SOLUTION W/CLAMP 6SON; Manufacturer: Texas Instruments; Power (Watts): 60W; Number of Circuits: 4; Supplier 1: Digi-Key; RoHS: RoHS Compliant; Category: Circuit Protection; Stock 1: 35000; Pricing 1: 5000=0.23625 (USD); Packaging: Tape & Reel (TR); Part Status: Active; Voltage - Working: -; Voltage - Clamping: -; Technology: Mixed Technology; Applications: USB; Package / Case: 6-UFDFN; Supplier Device Package: 6-SON (1.45x1); ComponentLink1URL: http://www.ti.com/lit/ds/symlink/tpd4s012.pdf; ComponentLink1Description: http://www.ti.com/lit/ds/symlink/tpd4s012.pdf; Supplier Part Number 1: 296-24244-2-ND

## Sheet [06] - PROCESSOR 3 of 3. EXPANSION.SchDoc
size A2; DocumentNumber: 6; SheetNumber: 6; SheetTotal: 13; NameAuthor: Angle Vu
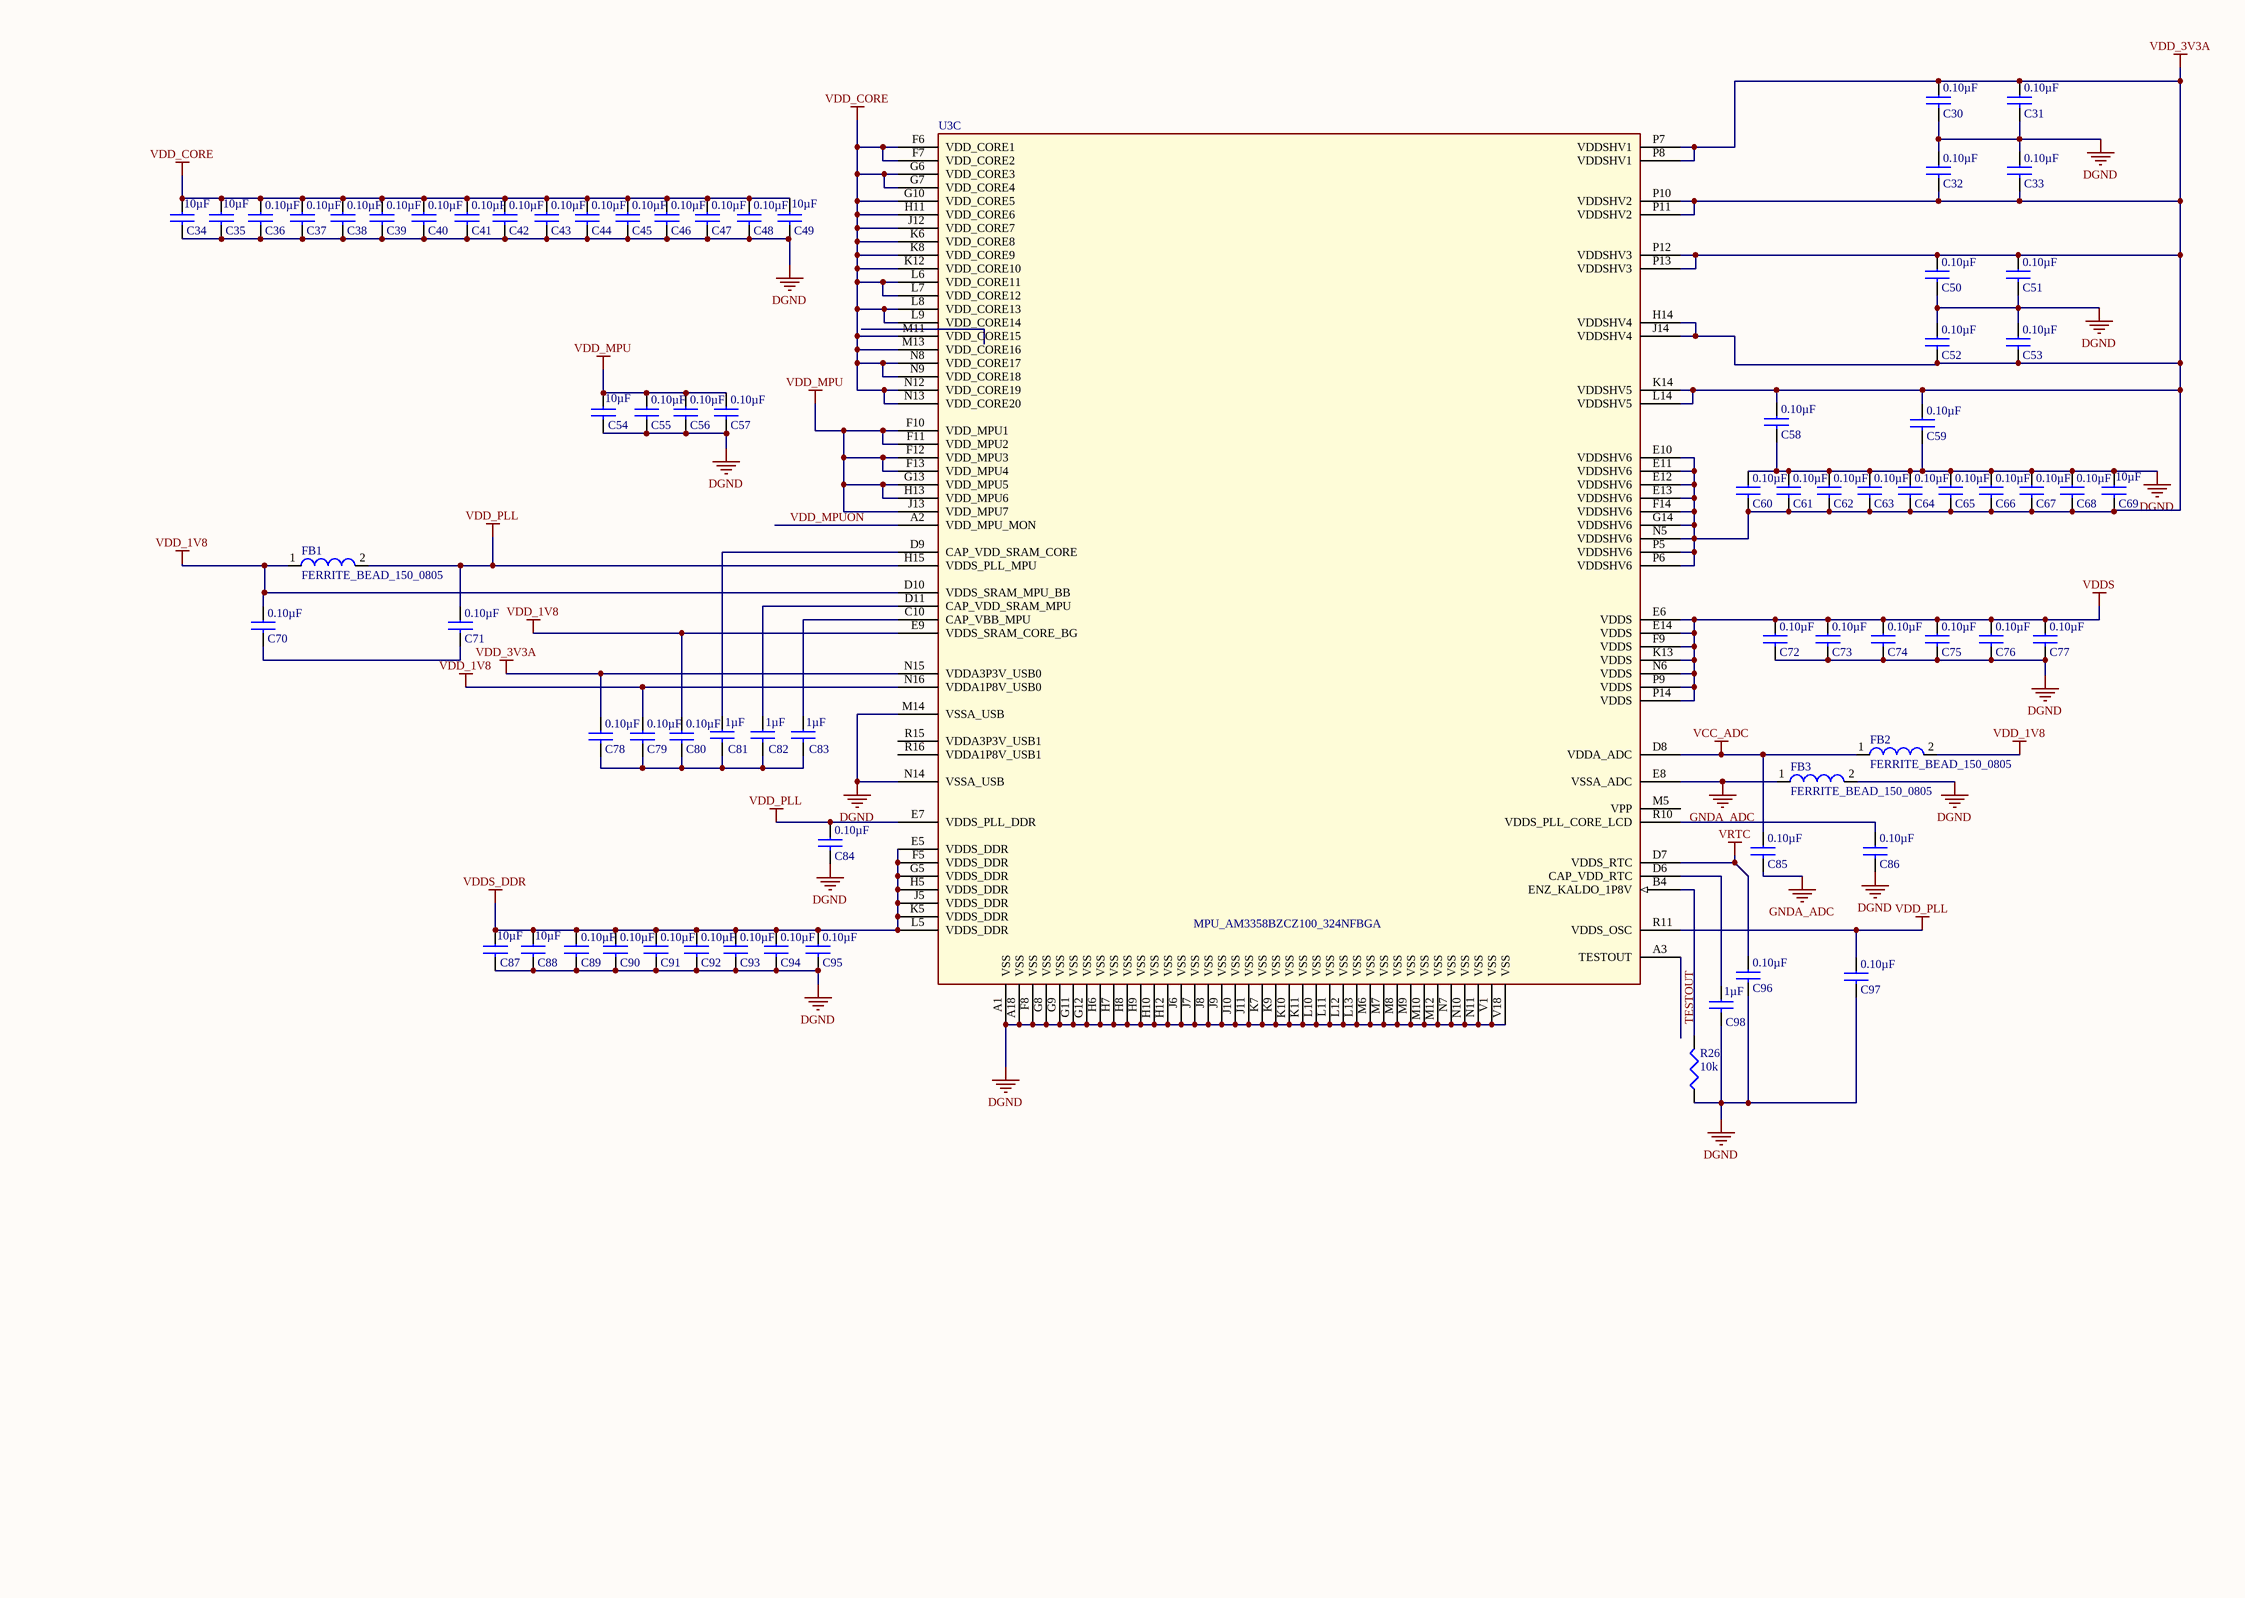
[diagram p7: [06] - PROCESSOR 3 of 3. EXPANSION.SchDoc]

### Parts
C30  Capacitance: 0.10µF  (hidden comment: C_CER_0.1uF_6.3V_X5R_0402_10%)
C31  Capacitance: 0.10µF  (hidden comment: C_CER_0.1uF_6.3V_X5R_0402_10%)
C32  Capacitance: 0.10µF  (hidden comment: C_CER_0.1uF_6.3V_X5R_0402_10%)
C33  Capacitance: 0.10µF  (hidden comment: C_CER_0.1uF_6.3V_X5R_0402_10%)
C34  Capacitance: 10µF  (hidden comment: C_CER_10uF_10V_X7R_0805_10%)
C35  Capacitance: 10µF  (hidden comment: C_CER_10uF_10V_X7R_0805_10%)
C36  Capacitance: 0.10µF  (hidden comment: C_CER_0.1uF_6.3V_X5R_0402_10%)
C37  Capacitance: 0.10µF  (hidden comment: C_CER_0.1uF_6.3V_X5R_0402_10%)
C38  Capacitance: 0.10µF  (hidden comment: C_CER_0.1uF_6.3V_X5R_0402_10%)
C39  Capacitance: 0.10µF  (hidden comment: C_CER_0.1uF_6.3V_X5R_0402_10%)
C40  Capacitance: 0.10µF  (hidden comment: C_CER_0.1uF_6.3V_X5R_0402_10%)
C41  Capacitance: 0.10µF  (hidden comment: C_CER_0.1uF_6.3V_X5R_0402_10%)
C42  Capacitance: 0.10µF  (hidden comment: C_CER_0.1uF_6.3V_X5R_0402_10%)
C43  Capacitance: 0.10µF  (hidden comment: C_CER_0.1uF_6.3V_X5R_0402_10%)
C44  Capacitance: 0.10µF  (hidden comment: C_CER_0.1uF_6.3V_X5R_0402_10%)
C45  Capacitance: 0.10µF  (hidden comment: C_CER_0.1uF_6.3V_X5R_0402_10%)
C46  Capacitance: 0.10µF  (hidden comment: C_CER_0.1uF_6.3V_X5R_0402_10%)
C47  Capacitance: 0.10µF  (hidden comment: C_CER_0.1uF_6.3V_X5R_0402_10%)
C48  Capacitance: 0.10µF  (hidden comment: C_CER_0.1uF_6.3V_X5R_0402_10%)
C49  Capacitance: 10µF  (hidden comment: C_CER_10uF_10V_X7R_0805_10%)
C50  Capacitance: 0.10µF  (hidden comment: C_CER_0.1uF_6.3V_X5R_0402_10%)
C51  Capacitance: 0.10µF  (hidden comment: C_CER_0.1uF_6.3V_X5R_0402_10%)
C52  Capacitance: 0.10µF  (hidden comment: C_CER_0.1uF_6.3V_X5R_0402_10%)
C53  Capacitance: 0.10µF  (hidden comment: C_CER_0.1uF_6.3V_X5R_0402_10%)
C54  Capacitance: 10µF  (hidden comment: C_CER_10uF_10V_X7R_0805_10%)
C55  Capacitance: 0.10µF  (hidden comment: C_CER_0.1uF_6.3V_X5R_0402_10%)
C56  Capacitance: 0.10µF  (hidden comment: C_CER_0.1uF_6.3V_X5R_0402_10%)
C57  Capacitance: 0.10µF  (hidden comment: C_CER_0.1uF_6.3V_X5R_0402_10%)
C58  Capacitance: 0.10µF  (hidden comment: C_CER_0.1uF_6.3V_X5R_0402_10%)
C59  Capacitance: 0.10µF  (hidden comment: C_CER_0.1uF_6.3V_X5R_0402_10%)
C60  Capacitance: 0.10µF  (hidden comment: C_CER_0.1uF_6.3V_X5R_0402_10%)
C61  Capacitance: 0.10µF  (hidden comment: C_CER_0.1uF_6.3V_X5R_0402_10%)
C62  Capacitance: 0.10µF  (hidden comment: C_CER_0.1uF_6.3V_X5R_0402_10%)
C63  Capacitance: 0.10µF  (hidden comment: C_CER_0.1uF_6.3V_X5R_0402_10%)
C64  Capacitance: 0.10µF  (hidden comment: C_CER_0.1uF_6.3V_X5R_0402_10%)
C65  Capacitance: 0.10µF  (hidden comment: C_CER_0.1uF_6.3V_X5R_0402_10%)
C66  Capacitance: 0.10µF  (hidden comment: C_CER_0.1uF_6.3V_X5R_0402_10%)
C67  Capacitance: 0.10µF  (hidden comment: C_CER_0.1uF_6.3V_X5R_0402_10%)
C68  Capacitance: 0.10µF  (hidden comment: C_CER_0.1uF_6.3V_X5R_0402_10%)
C69  Capacitance: 10µF  (hidden comment: C_CER_10uF_10V_X7R_0805_10%)
C70  Capacitance: 0.10µF  (hidden comment: C_CER_0.1uF_6.3V_X5R_0402_10%)
C71  Capacitance: 0.10µF  (hidden comment: C_CER_0.1uF_6.3V_X5R_0402_10%)
C72  Capacitance: 0.10µF  (hidden comment: C_CER_0.1uF_6.3V_X5R_0402_10%)
C73  Capacitance: 0.10µF  (hidden comment: C_CER_0.1uF_6.3V_X5R_0402_10%)
C74  Capacitance: 0.10µF  (hidden comment: C_CER_0.1uF_6.3V_X5R_0402_10%)
C75  Capacitance: 0.10µF  (hidden comment: C_CER_0.1uF_6.3V_X5R_0402_10%)
C76  Capacitance: 0.10µF  (hidden comment: C_CER_0.1uF_6.3V_X5R_0402_10%)
C77  Capacitance: 0.10µF  (hidden comment: C_CER_0.1uF_6.3V_X5R_0402_10%)
C78  Capacitance: 0.10µF  (hidden comment: C_CER_0.1uF_6.3V_X5R_0402_10%)
C79  Capacitance: 0.10µF  (hidden comment: C_CER_0.1uF_6.3V_X5R_0402_10%)
C80  Capacitance: 0.10µF  (hidden comment: C_CER_0.1uF_6.3V_X5R_0402_10%)
C81  Capacitance: 1µF  (hidden comment: C_CER_1uF_6.3V_X5R_0402_10%)
C82  Capacitance: 1µF  (hidden comment: C_CER_1uF_6.3V_X5R_0402_10%)
C83  Capacitance: 1µF  (hidden comment: C_CER_1uF_6.3V_X5R_0402_10%)
C84  Capacitance: 0.10µF  (hidden comment: C_CER_0.1uF_6.3V_X5R_0402_10%)
C85  Capacitance: 0.10µF  (hidden comment: C_CER_0.1uF_6.3V_X5R_0402_10%)
C86  Capacitance: 0.10µF  (hidden comment: C_CER_0.1uF_6.3V_X5R_0402_10%)
C87  Capacitance: 10µF  (hidden comment: C_CER_10uF_10V_X7R_0805_10%)
C88  Capacitance: 10µF  (hidden comment: C_CER_10uF_10V_X7R_0805_10%)
C89  Capacitance: 0.10µF  (hidden comment: C_CER_0.1uF_6.3V_X5R_0402_10%)
C90  Capacitance: 0.10µF  (hidden comment: C_CER_0.1uF_6.3V_X5R_0402_10%)
C91  Capacitance: 0.10µF  (hidden comment: C_CER_0.1uF_6.3V_X5R_0402_10%)
C92  Capacitance: 0.10µF  (hidden comment: C_CER_0.1uF_6.3V_X5R_0402_10%)
C93  Capacitance: 0.10µF  (hidden comment: C_CER_0.1uF_6.3V_X5R_0402_10%)
C94  Capacitance: 0.10µF  (hidden comment: C_CER_0.1uF_6.3V_X5R_0402_10%)
C95  Capacitance: 0.10µF  (hidden comment: C_CER_0.1uF_6.3V_X5R_0402_10%)
C96  Capacitance: 0.10µF  (hidden comment: C_CER_0.1uF_6.3V_X5R_0402_10%)
C97  Capacitance: 0.10µF  (hidden comment: C_CER_0.1uF_6.3V_X5R_0402_10%)
C98  Capacitance: 1µF  (hidden comment: C_CER_1uF_6.3V_X5R_0402_10%)
FB1  FERRITE_BEAD_150_0805
FB2  FERRITE_BEAD_150_0805
FB3  FERRITE_BEAD_150_0805
R26  Resistance (Ohms): 10k  (hidden comment: R_10K_1/16W_0402_1%)
U3  MPU_AM3358BZCZ100_324NFBGA  (part C of 3)

### Nets
DGND: C30.2 C31.2 C32.1 C33.1 C34.2 C35.2 C36.2 C37.2 C38.2 C39.2 C40.2 C41.2 C42.2 C43.2 C44.2 C45.2 C46.2 C47.2 C48.2 C49.2 C50.2 C51.2 C52.1 C53.1 C54.2 C55.2 C56.2 C57.2 C58.2 C59.2 C60.1 C61.1 C62.1 C63.1 C64.1 C65.1 C66.1 C67.1 C68.1 C69.1 C72.2 C73.2 C74.2 C75.2 C76.2 C77.2 C84.2 C86.2 C87.2 C88.2 C89.2 C90.2 C91.2 C92.2 C93.2 C94.2 C95.2 C96.2 C97.2 C98.2 FB3.2 R26.1 U3.A1(VSS) U3.A18(VSS) U3.F8(VSS) U3.G8(VSS) U3.G9(VSS) U3.G11(VSS) U3.G12(VSS) U3.H6(VSS) U3.H7(VSS) U3.H8(VSS) U3.H9(VSS) U3.H10(VSS) U3.H12(VSS) U3.J6(VSS) U3.J7(VSS) U3.J8(VSS) U3.J9(VSS) U3.J10(VSS) U3.J11(VSS) U3.K7(VSS) U3.K9(VSS) U3.K10(VSS) U3.K11(VSS) U3.L10(VSS) U3.L11(VSS) U3.L12(VSS) U3.L13(VSS) U3.M6(VSS) U3.M7(VSS) U3.M8(VSS) U3.M9(VSS) U3.M10(VSS) U3.M12(VSS) U3.M14(VSSA_USB) U3.N7(VSS) U3.N10(VSS) U3.N11(VSS) U3.N14(VSSA_USB) U3.V1(VSS) U3.V18(VSS)  [project net GND_OSC0]
GNDA_ADC: C85.2 FB3.1 U3.E8(VSSA_ADC)
VCC_ADC: C85.1 FB2.1 U3.D8(VDDA_ADC)
VDD_1V8: C70.1 C79.1 C80.1 FB1.1 FB2.2 U3.D10(VDDS_SRAM_MPU_BB) U3.E9(VDDS_SRAM_CORE_BG) U3.N16(VDDA1P8V_USB0)
VDD_3V3A: C30.1 C31.1 C32.2 C33.2 C50.1 C51.1 C52.2 C53.2 C58.1 C59.1 C60.2 C61.2 C62.2 C63.2 C64.2 C65.2 C66.2 C67.2 C68.2 C69.2 C78.1 U3.E10(VDDSHV6) U3.E11(VDDSHV6) U3.E12(VDDSHV6) U3.E13(VDDSHV6) U3.F14(VDDSHV6) U3.G14(VDDSHV6) U3.H14(VDDSHV4) U3.J14(VDDSHV4) U3.K14(VDDSHV5) U3.L14(VDDSHV5) U3.N5(VDDSHV6) U3.N15(VDDA3P3V_USB0) U3.P5(VDDSHV6) U3.P6(VDDSHV6) U3.P7(VDDSHV1) U3.P8(VDDSHV1) U3.P10(VDDSHV2) U3.P11(VDDSHV2) U3.P12(VDDSHV3) U3.P13(VDDSHV3)
VDD_CORE: C34.1 C35.1 C36.1 C37.1 C38.1 C39.1 C40.1 C41.1 C42.1 C43.1 C44.1 C45.1 C46.1 C47.1 C48.1 C49.1 U3.F6(VDD_CORE1) U3.F7(VDD_CORE2) U3.G6(VDD_CORE3) U3.G7(VDD_CORE4) U3.G10(VDD_CORE5) U3.H11(VDD_CORE6) U3.J12(VDD_CORE7) U3.K6(VDD_CORE8) U3.K8(VDD_CORE9) U3.K12(VDD_CORE10) U3.L6(VDD_CORE11) U3.L7(VDD_CORE12) U3.L8(VDD_CORE13) U3.L9(VDD_CORE14) U3.M11(VDD_CORE15) U3.M13(VDD_CORE16) U3.N8(VDD_CORE17) U3.N9(VDD_CORE18) U3.N12(VDD_CORE19) U3.N13(VDD_CORE20)
VDD_MPU: C54.1 C55.1 C56.1 C57.1 U3.F10(VDD_MPU1) U3.F11(VDD_MPU2) U3.F12(VDD_MPU3) U3.F13(VDD_MPU4) U3.G13(VDD_MPU5) U3.H13(VDD_MPU6) U3.J13(VDD_MPU7)
VDD_PLL: C71.1 C84.1 C97.1 FB1.2 U3.E7(VDDS_PLL_DDR) U3.H15(VDDS_PLL_MPU) U3.R11(VDDS_OSC)
VDDS: C72.1 C73.1 C74.1 C75.1 C76.1 C77.1 U3.E6(VDDS) U3.E14(VDDS) U3.F9(VDDS) U3.K13(VDDS) U3.N6(VDDS) U3.P9(VDDS) U3.P14(VDDS)
VDDS_DDR: C87.1 C88.1 C89.1 C90.1 C91.1 C92.1 C93.1 C94.1 C95.1 U3.E5(VDDS_DDR) U3.F5(VDDS_DDR) U3.G5(VDDS_DDR) U3.H5(VDDS_DDR) U3.J5(VDDS_DDR) U3.K5(VDDS_DDR) U3.L5(VDDS_DDR)
VRTC: C96.1 U3.D7(VDDS_RTC)
TESTOUT: U3.A3(TESTOUT)
VDD_MPUON: U3.A2(VDD_MPU_MON)
NetC70_2: C70.2 C71.2
NetC78_2: C78.2 C79.2 C80.2 C81.2 C82.2 C83.2
NetC81_1: C81.1 U3.D9(CAP_VDD_SRAM_CORE)
NetC82_1: C82.1 U3.D11(CAP_VDD_SRAM_MPU)
NetC83_1: C83.1 U3.C10(CAP_VBB_MPU)
NetC86_1: C86.1 U3.R10(VDDS_PLL_CORE_LCD)
NetC98_1: C98.1 U3.D6(CAP_VDD_RTC)
NetR26_2: R26.2 U3.B4(ENZ_KALDO_1P8V)

Not connected (* = marked no-connect by the designer): U3 M5(VPP) R15(VDDA3P3V_USB1) R16(VDDA1P8V_USB1)

### Notes on the sheet
- CLOCKS (CPU & PCIE)
- Designed By
- Checked By
- Page Name:
- Size:
- A2
- Company:
- Address:
- Sheet:
- /
- (in symbol BeagleBoard_org) Title; Size; Document Number; Rev; Date:; Sheet; of

### Library data of the parts
C30-C33 C36-C48 C50-C53 C55-C68 C70-C80 C84-C86 C89-C97 = C_CER_0.1uF_6.3V_X5R_0402_10%: as C25 on sheet [05] - PROCESSOR 2 of 3, USB and SERIAL; Supplier 1: Digi-Key; RoHS: RoHS Compliant; Category: Capacitors; Stock 1: 370000; Pricing 1: 10000=0.0021, 20000=0.002, 30000=0.0019, 50000=0.0017, 100000=0.00138 (USD); Packaging: Tape & Reel (TR); Part Status: Active; Voltage - Rated: 6.3V; Temperature Coefficient: X5R; Operating Temperature: -55°C ~ 85°C; Features: -; Ratings: -; Applications: General Purpose; Failure Rate: *; Mounting Type: Surface Mount, MLCC; Package / Case: 0402 (1005 Metric); Size / Dimension: 0.039" L x 0.020" W (1.00mm x 0.50mm); Height - Seated (Max): -; Thickness (Max): 0.022" (0.55mm); Lead Spacing: -; Lead Style: -; ComponentLink1URL: http://www.murata.com/~/media/webrenewal/support/library/catalog/products/capacitor/mlcc/c02e.pdf; ComponentLink1Description: http://www.murata.com/~/media/webrenewal/support/library/catalog/products/capacitor/mlcc/c02e.pdf; Supplier Part Number 1: 490-6287-2-ND
C34 C35 C49 C54 C69 C87 C88 = C_CER_10uF_10V_X7R_0805_10%: CAP CER 10UF 10V X7R 0805; Manufacturer: Murata Electronics North America; Manufacturer Part Number: GRM21BR71A106KE51L; Tolerance: ±10%; Supplier 1: Digi-Key; RoHS: RoHS Compliant; Category: Capacitors; Stock 1: 966000; Pricing 1: 3000=0.05, 6000=0.04625, 9000=0.04375, 15000=0.0415, 30000=0.04, 75000=0.0375, 150000=0.03313 (USD); Packaging: Tape & Reel (TR); Part Status: Active; Voltage - Rated: 10V; Temperature Coefficient: X7R; Operating Temperature: -55°C ~ 125°C; Features: -; Ratings: -; Applications: General Purpose; Failure Rate: *; Mounting Type: Surface Mount, MLCC; Package / Case: 0805 (2012 Metric); Size / Dimension: 0.079" L x 0.049" W (2.00mm x 1.25mm); Height - Seated (Max): -; Thickness (Max): 0.053" (1.35mm); Lead Spacing: -; Lead Style: -; ComponentLink1URL: http://www.murata.com/~/media/webrenewal/support/library/catalog/products/capacitor/mlcc/c02e.pdf; ComponentLink1Description: http://www.murata.com/~/media/webrenewal/support/library/catalog/products/capacitor/mlcc/c02e.pdf; Supplier Part Number 1: 490-3905-2-ND
C81-C83 C98 = C_CER_1uF_6.3V_X5R_0402_10%: CAP CER 1UF 6.3V X5R 0402; Manufacturer: Murata Electronics North America; Manufacturer Part Number: GRM155R60J105KE19D; Tolerance: ±10%; Supplier 1: Digi-Key; RoHS: RoHS Compliant; Category: Capacitors; Stock 1: 3360000; Pricing 1: 10000=0.00365, 20000=0.00348, 30000=0.00331, 50000=0.00296, 100000=0.00239 (USD); Packaging: Tape & Reel (TR); Part Status: Active; Voltage - Rated: 6.3V; Temperature Coefficient: X5R; Operating Temperature: -55°C ~ 85°C; Features: -; Ratings: -; Applications: General Purpose; Failure Rate: *; Mounting Type: Surface Mount, MLCC; Package / Case: 0402 (1005 Metric); Size / Dimension: 0.039" L x 0.020" W (1.00mm x 0.50mm); Height - Seated (Max): -; Thickness (Max): 0.022" (0.55mm); Lead Spacing: -; Lead Style: -; ComponentLink1URL: http://www.murata.com/~/media/webrenewal/support/library/catalog/products/capacitor/mlcc/c02e.pdf; ComponentLink1Description: http://www.murata.com/~/media/webrenewal/support/library/catalog/products/capacitor/mlcc/c02e.pdf; Supplier Part Number 1: 490-1320-2-ND
FB1-FB3 = FERRITE_BEAD_150_0805: FERRITE BEAD 150 OHM 0805 1LN; Manufacturer: Murata Electronics North America; Manufacturer Part Number: BLM21AG151SN1D; Number of Lines: 1; Impedance @ Frequency: 150 Ohm @ 100MHz; Current Rating (Max): 800mA; DC Resistance (DCR) (Max): 100 mOhm; Supplier 1: Digi-Key; RoHS: RoHS Compliant; Category: Filters; Stock 1: 24000; Pricing 1: 4000=0.01824, 8000=0.01653, 12000=0.01596, 28000=0.01482, 100000=0.01465 (USD); Packaging: Tape & Reel (TR); Part Status: Active; Filter Type: -; Ratings: -; Operating Temperature: -55°C ~ 125°C; Package / Case: 0805 (2012 Metric); Mounting Type: Surface Mount; Height (Max): 0.041" (1.05mm); Size / Dimension: 0.079" L x 0.049" W (2.00mm x 1.25mm); ComponentLink1URL: http://search.murata.co.jp/Ceramy/image/img/PDF/ENG/L0110S0100BLM21A.pdf; ComponentLink1Description: http://search.murata.co.jp/Ceramy/image/img/PDF/ENG/L0110S0100BLM21A.pdf; Supplier Part Number 1: 490-9703-2-ND
R26 = R_10K_1/16W_0402_1%: RES SMD 10K OHM 1% 1/16W 0402; Manufacturer: Yageo; Manufacturer Part Number: RC0402FR-0710KL; Power (Watts): 0.063W, 1/16W; Temperature Coefficient: ±100ppm/°C; Supplier 1: Digi-Key; RoHS: RoHS Compliant; Category: Resistors; Stock 1: 13060454; Pricing 1: 1=0.1, 10=0.013, 25=0.0096, 100=0.0054, 250=0.00412, 500=0.00328, 1000=0.00242, 2500=0.0021, 5000=0.00173 (USD); Packaging: Cut Tape (CT); Part Status: Active; Tolerance: ±1%; Composition: Thick Film; Features: Moisture Resistant; Operating Temperature: -55°C ~ 155°C; Package / Case: 0402 (1005 Metric); Supplier Device Package: 0402; Size / Dimension: 0.039" L x 0.020" W (1.00mm x 0.50mm); Height: 0.016" (0.40mm); Number of Terminations: 2; Failure Rate: -; ComponentLink1URL: http://www.yageo.com/documents/recent/PYu-RC_Group_51_RoHS_L_04.pdf; ComponentLink1Description: http://www.yageo.com/documents/recent/PYu-RC_Group_51_RoHS_L_04.pdf; Supplier Part Number 1: 311-10.0KLRCT-ND
U3 = MPU_AM3358BZCZ100_324NFBGA: as U3 on sheet [05] - PROCESSOR 2 of 3, USB and SERIAL; Supplier 1: Digi-Key; Manufacturer Part Number: AM3358BZCZ100; RoHS: RoHS Compliant; Category: Integrated Circuits (ICs); Stock 1: 6211; Pricing 1: 1=19.56, 10=17.978, 100=15.1835, 500=13.50676, 1000=12.38895, 2500=11.9232, 5000=11.64375 (USD); Packaging: Tube; Part Status: Active; Speed: 1.0GHz; SATA: -; Operating Temperature: 0°C ~ 90°C (TJ); Package / Case: 324-LFBGA; Supplier Device Package: 324-NFBGA(15x15); ComponentLink1URL: http://www.ti.com/lit/ds/symlink/am3352.pdf; ComponentLink1Description: http://www.ti.com/lit/ds/symlink/am3352.pdf; Supplier Part Number 1: 296-35869-5-ND

## Sheet [07] - LED, CONFIG, & BUTTON.SchDoc
size A2; DocumentNumber: 7; SheetNumber: 7; SheetTotal: 13; NameAuthor: Angle Vu
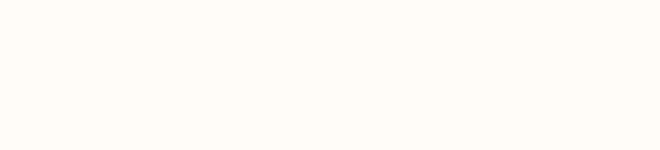
[diagram p8: [07] - LED, CONFIG, & BUTTON.SchDoc]

### Notes on the sheet
- CLOCKS (CPU & PCIE)
- Designed By
- Checked By
- Page Name:
- Size:
- A2
- Company:
- Address:
- Sheet:
- /
- (in symbol BeagleBoard_org) Title; Size; Document Number; Rev; Date:; Sheet; of
- (in symbol LED_LTST-C150GKT) GRN

## Sheet [08] - DDR3 MEMORY.SchDoc
size A2; DocumentNumber: 8; SheetNumber: 8; SheetTotal: 13; NameAuthor: Angle Vu
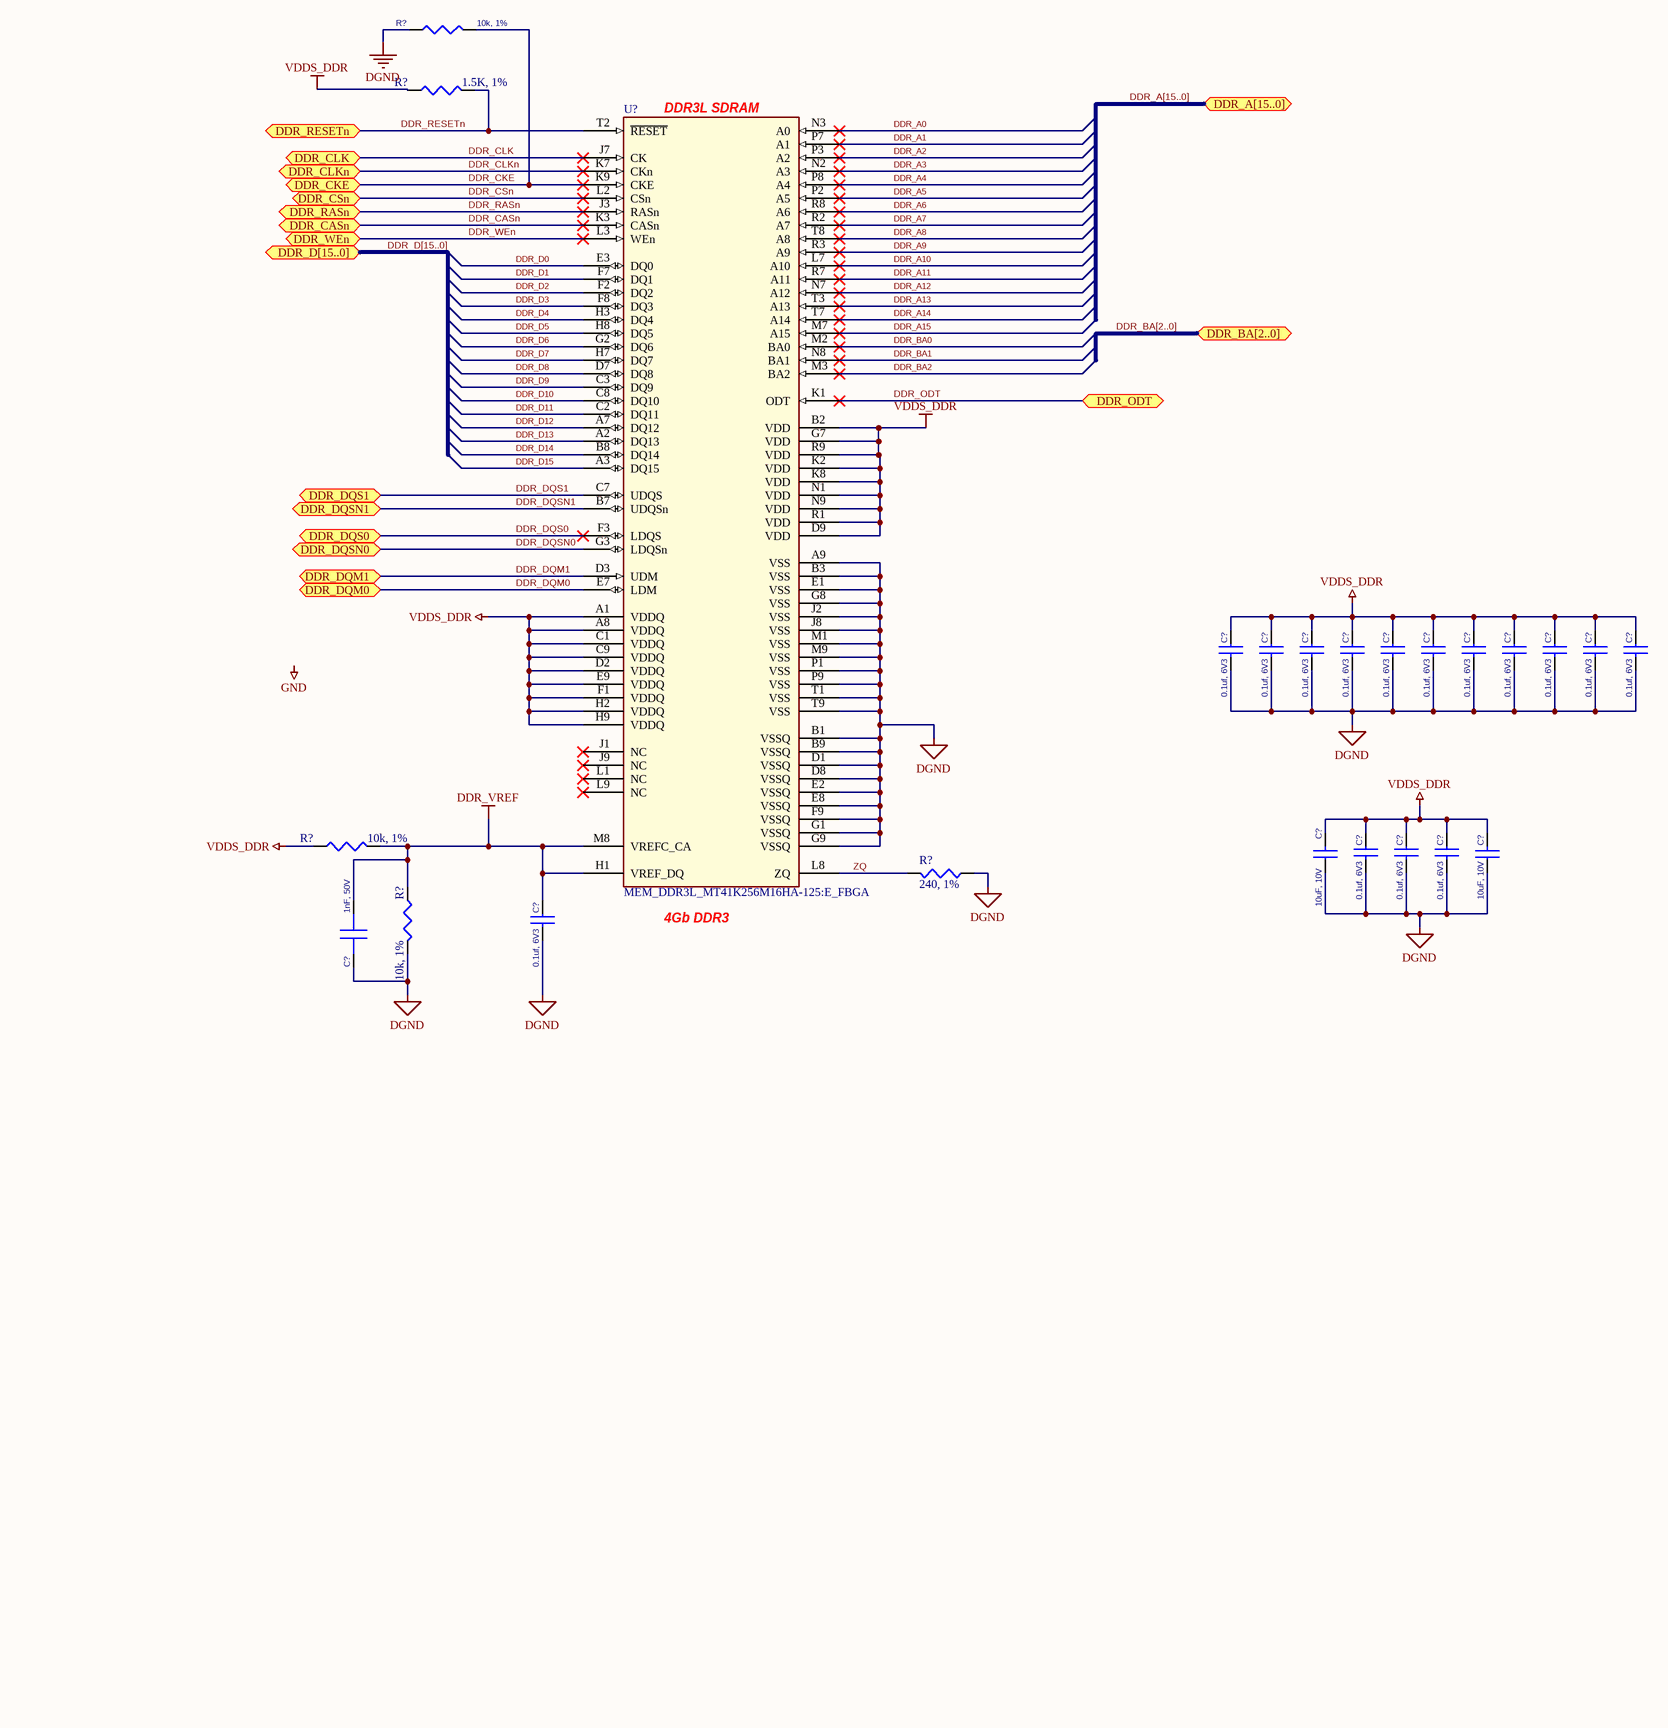
[diagram p9: [08] - DDR3 MEMORY.SchDoc]

### Parts
(Parts that share a designator on the sheet are numbered #1, #2 ... from top to bottom, then left to right.)
C?#1  0.1uf, 6V3  [402]
C?#2  0.1uf, 6V3  [402]
C?#3  0.1uf, 6V3  [402]
C?#4  0.1uf, 6V3  [402]
C?#5  0.1uf, 6V3  [402]
C?#6  0.1uf, 6V3  [402]
C?#7  0.1uf, 6V3  [402]
C?#8  0.1uf, 6V3  [402]
C?#9  0.1uf, 6V3  [402]
C?#10  0.1uf, 6V3  [402]
C?#11  0.1uf, 6V3  [402]
C?#12  0.1uf, 6V3  [402]
C?#13  0.1uf, 6V3  [402]
C?#14  0.1uf, 6V3  [402]
C?#15  10uF, 10V  [805]
C?#16  10uF, 10V  [805]
C?#17  1nF, 50V  [402]
C?#18  0.1uf, 6V3  [402]
R?#1  10k, 1%  [402]
R?#2  1.5K, 1%  [402]
R?#3  10k, 1%  [402]
R?#4  240, 1%  [402]
R?#5  10k, 1%  [402]
U?  MEM_DDR3L_MT41K256M16HA-125:E_FBGA

### Ports
DDR_A[15..0], DDR_BA[2..0], DDR_CASn, DDR_CKE, DDR_CLK, DDR_CLKn, DDR_CSn, DDR_D[15..0], DDR_DQM0, DDR_DQM1, DDR_DQS0, DDR_DQS1, DDR_DQSN0, DDR_DQSN1, DDR_ODT, DDR_RASn, DDR_RESETn, DDR_WEn

### Nets
DDR_VREF: C?#17.1 C?#18.1 R?#3.2 R?#5.1 U?.H1(VREF_DQ) U?.M8(VREFC_CA)
DGND: C?#1.2 C?#2.2 C?#3.2 C?#4.2 C?#5.2 C?#6.2 C?#7.2 C?#8.2 C?#9.2 C?#10.2 C?#11.2 C?#12.2 C?#13.2 C?#14.2 C?#15.1 C?#16.1 C?#17.2 C?#18.2 R?#1.1 R?#4.1 R?#5.2 U?.A9(VSS) U?.B1(VSSQ) U?.B3(VSS) U?.B9(VSSQ) U?.D1(VSSQ) U?.D8(VSSQ) U?.E1(VSS) U?.E2(VSSQ) U?.E8(VSSQ) U?.F9(VSSQ) U?.G1(VSSQ) U?.G8(VSS) U?.G9(VSSQ) U?.J2(VSS) U?.J8(VSS) U?.M1(VSS) U?.M9(VSS) U?.P1(VSS) U?.P9(VSS) U?.T1(VSS) U?.T9(VSS)  [project net GND_OSC0]
VDDS_DDR: C?#1.1 C?#2.1 C?#3.1 C?#4.1 C?#5.1 C?#6.1 C?#7.1 C?#8.1 C?#9.1 C?#10.1 C?#11.1 C?#12.1 C?#13.1 C?#14.1 C?#15.2 C?#16.2 R?#2.1 R?#3.1 U?.A1(VDDQ) U?.A8(VDDQ) U?.B2(VDD) U?.C1(VDDQ) U?.C9(VDDQ) U?.D2(VDDQ) U?.D9(VDD) U?.E9(VDDQ) U?.F1(VDDQ) U?.G7(VDD) U?.H2(VDDQ) U?.H9(VDDQ) U?.K2(VDD) U?.K8(VDD) U?.N1(VDD) U?.N9(VDD) U?.R1(VDD) U?.R9(VDD)
DDR_A0: U?.N3(A0)
DDR_A1: U?.P7(A1)
DDR_A2: U?.P3(A2)
DDR_A3: U?.N2(A3)
DDR_A4: U?.P8(A4)
DDR_A5: U?.P2(A5)
DDR_A6: U?.R8(A6)
DDR_A7: U?.R2(A7)
DDR_A8: U?.T8(A8)
DDR_A9: U?.R3(A9)
DDR_A10: U?.L7(A10)
DDR_A11: U?.R7(A11)
DDR_A12: U?.N7(A12)
DDR_A13: U?.T3(A13)
DDR_A14: U?.T7(A14)
DDR_A15: U?.M7(A15)
DDR_BA0: U?.M2(BA0)
DDR_BA1: U?.N8(BA1)
DDR_BA2: U?.M3(BA2)
DDR_CASn: U?.K3(CASn) ; port DDR_CASn
DDR_CKE: R?#1.2 U?.K9(CKE) ; port DDR_CKE
DDR_CLK: U?.J7(CK) ; port DDR_CLK
DDR_CLKn: U?.K7(CKn) ; port DDR_CLKn
DDR_CSn: U?.L2(CSn) ; port DDR_CSn
DDR_D0: U?.E3(DQ0)
DDR_D1: U?.F7(DQ1)
DDR_D2: U?.F2(DQ2)
DDR_D3: U?.F8(DQ3)
DDR_D4: U?.H3(DQ4)
DDR_D5: U?.H8(DQ5)
DDR_D6: U?.G2(DQ6)
DDR_D7: U?.H7(DQ7)
DDR_D8: U?.D7(DQ8)
DDR_D9: U?.C3(DQ9)
DDR_D10: U?.C8(DQ10)
DDR_D11: U?.C2(DQ11)
DDR_D12: U?.A7(DQ12)
DDR_D13: U?.A2(DQ13)
DDR_D14: U?.B8(DQ14)
DDR_D15: U?.A3(DQ15)
DDR_DQM0: U?.E7(LDM) ; port DDR_DQM0
DDR_DQM1: U?.D3(UDM) ; port DDR_DQM1
DDR_DQS0: U?.F3(LDQS) ; port DDR_DQS0
DDR_DQS1: U?.C7(UDQS) ; port DDR_DQS1
DDR_DQSN0: U?.G3(LDQSn) ; port DDR_DQSN0
DDR_DQSN1: U?.B7(UDQSn) ; port DDR_DQSN1
DDR_ODT: U?.K1(ODT) ; port DDR_ODT
DDR_RASn: U?.J3(RASn) ; port DDR_RASn
DDR_RESETn: R?#2.2 U?.T2(~{RESET}) ; port DDR_RESETn
DDR_WEn: U?.L3(WEn) ; port DDR_WEn
ZQ: R?#4.2 U?.L8(ZQ)

Not connected (* = marked no-connect by the designer): U? J1(NC)* J9(NC)* L1(NC)* L9(NC)*

### Buses and harness runs
bus DDR_A[15..0] = port DDR_A[15..0]
bus DDR_BA[2..0] = port DDR_BA[2..0]
bus DDR_D[15..0] = port DDR_D[15..0]

### Notes on the sheet
- (near U?) DDR3L SDRAM
- (near U?) 4Gb DDR3
- CLOCKS (CPU & PCIE)
- Labels drawn without touching a wire or pin: GND
- Designed By
- Checked By
- Page Name:
- Size:
- A2
- Company:
- Address:
- Sheet:
- /
- (in symbol BeagleBoard_org) Title; Size; Document Number; Rev; Date:; Sheet; of

### Library data of the parts
C?#1-C?#14 C?#18 = CAP_0.01uf_X7R_16V_10%_0402: CAP CER 0.1UF 6.3V 10% X5R 0402; Manufacturer: TDK Corporation; Manufacturer Part Number: C1005X5R0J104K050BA; Capacitance: 0.1µF; Supplier 1: Digi-Key; Supplier Part Number 1: 445-1266-6-ND; RoHS: RoHS Compliant; Category: Capacitors; Stock 1: 127604; Pricing 1: 1=0.1, 10=0.026, 100=0.0121, 250=0.00992, 500=0.00848, 1000=0.0066, 5000=0.0055 (USD); Voltage - Rated: 6.3V; Tolerance: ±10%; Temperature Coefficient: X5R; Mounting Type: Surface Mount, MLCC; Operating Temperature: -55°C ~ 85°C; Applications: General Purpose; Ratings: -; Package / Case: 0402 (1005 Metric); Size / Dimension: 0.039" L x 0.020" W (1.00mm x 0.50mm); Height - Seated (Max): -; Thickness (Max): 0.022" (0.55mm); Lead Spacing: -; Features: -; Packaging: Digi-Reel®; Lead Style: -; ComponentLink1URL: http://www.kemet.com/datasheets&C0402C104K4RACTU; ComponentLink1Description: http://www.kemet.com/datasheets&C0402C104K4RACTU
C?#15 C?#16 = CAP_4.7uF_X5R_6.3V_10%_0603: CAP CER 10UF 10V Y5V 0805; Manufacturer: TDK Corporation; Manufacturer Part Number: C2012Y5V1A106Z; Capacitance: 10µF; Tolerance: -20%, +80%; Temperature Coefficient: Y5V (F); Supplier 1: Digi-Key; Supplier Part Number 1: 445-1371-6-ND; RoHS: RoHS Compliant; Category: Capacitors; Stock 1: 102071; Pricing 1: 1=0.15, 10=0.105, 100=0.0499, 250=0.042, 500=0.03518, 1000=0.02887 (USD); Voltage - Rated: 10V; Mounting Type: Surface Mount, MLCC; Operating Temperature: -30°C ~ 85°C; Applications: General Purpose; Ratings: -; Package / Case: 0805 (2012 Metric); Size / Dimension: 0.079" L x 0.049" W (2.00mm x 1.25mm); Height - Seated (Max): -; Thickness (Max): 0.057" (1.45mm); Lead Spacing: -; Features: -; Packaging: Digi-Reel®; Lead Style: -; ComponentLink1URL: http://media.digikey.com/pdf/Data%20Sheets/TDK%20PDFs/C_Series_GeneralAppl_B11.pdf; ComponentLink1Description: http://media.digikey.com/pdf/Data%20Sheets/TDK%20PDFs/C_Series_GeneralAppl_B11.pdf
C?#17 = CAP SMD: CAP CER 1000PF 16V 10% X7R 0402; Manufacturer: Yageo; Manufacturer Part Number: CC0402KRX7R7BB102; Supplier 1: Digi-Key; Supplier Part Number 1: 311-1352-6-ND; RoHS: RoHS Compliant; Category: Capacitors; Stock 1: 391222; Pricing 1: 1=0.1, 10=0.012, 25=0.0088, 100=0.0057, 250=0.00464, 500=0.00396, 1000=0.00309, 2500=0.00278, 5000=0.00258 (USD); Capacitance: 1000pF; Voltage - Rated: 16V; Tolerance: ±10%; Temperature Coefficient: X7R; Mounting Type: Surface Mount, MLCC; Operating Temperature: -55°C ~ 125°C; Applications: General Purpose; Ratings: -; Package / Case: 0402 (1005 Metric); Size / Dimension: 0.039" L x 0.020" W (1.00mm x 0.50mm); Height - Seated (Max): -; Thickness (Max): 0.022" (0.55mm); Lead Spacing: -; Features: -; Packaging: Digi-Reel®; Lead Style: -; ComponentLink1URL: http://www.yageo.com/documents/recent/UPY-GPHC_X7R_6.3V-to-50V_8.pdf; ComponentLink1Description: http://www.yageo.com/documents/recent/UPY-GPHC_X7R_6.3V-to-50V_8.pdf
R?#1 R?#3 R?#5 = RES_10K_1/16W_1%_0402: RES 10K OHM 1/16W 5% 0402 SMD; Manufacturer: Rohm Semiconductor; Manufacturer Part Number: MCR01MZPJ103; Power (Watts): 0.063W, 1/16W; Temperature Coefficient: ±200ppm/°C; Category: Resistors; ComponentLink1Description: http://rohmfs.rohm.com/en/products/databook/datasheet/passive/resistor/chip_resistor/mcr_a.pdf; ComponentLink1URL: http://rohmfs.rohm.com/en/products/databook/datasheet/passive/resistor/chip_resistor/mcr_a.pdf; Composition: Thick Film; Features: Automotive AEC-Q200 Qualified; Height: 0.016" (0.40mm); Number of Terminations: 2; Package / Case: 0402 (1005 Metric); Packaging: Digi-Reel®; Pricing 1: 1=0.1, 10=0.019, 25=0.014, 100=0.0078, 250=0.00596, 500=0.00476, 1000=0.0035, 5000=0.00251 (USD); Resistance (Ohms): 10k; RoHS: RoHS Compliant; Size / Dimension: 0.039" L x 0.020" W (1.00mm x 0.50mm); Stock 1: 110842; Supplier 1: Digi-Key; Supplier Device Package: 0402 (1005 Metric); Supplier Part Number 1: RHM10KJDKR-ND; Tolerance: ±5%
R?#2 = RES_10K_1/16W_1%_0402: RES 1.50K OHM 1/16W 1% 0402 SMD; Manufacturer: Yageo; Manufacturer Part Number: RC0402FR-071K5L; Power (Watts): 0.063W, 1/16W; Temperature Coefficient: ±100ppm/°C; Supplier 1: Digi-Key; Supplier Part Number 1: 311-1.50KLRDKR-ND; RoHS: RoHS Compliant; Category: Resistors; Stock 1: 433921; Pricing 1: 1=0.1, 10=0.014, 25=0.0104, 100=0.0063, 250=0.0054, 500=0.00382, 1000=0.0027, 2500=0.00234, 5000=0.00203 (USD); Resistance (Ohms): 1.5k; Composition: Thick Film; Features: -; Tolerance: ±1%; Package / Case: 0402 (1005 Metric); Supplier Device Package: 0402; Size / Dimension: 0.039" L x 0.020" W (1.00mm x 0.50mm); Height: 0.016" (0.40mm); Number of Terminations: 2; Packaging: Digi-Reel®; ComponentLink1URL: http://www.yageo.com/documents/recent/PYu-RC0402_51_RoHS_L_6.pdf; ComponentLink1Description: http://www.yageo.com/documents/recent/PYu-RC0402_51_RoHS_L_6.pdf
R?#4 = RES_10K_1/16W_1%_0402: RES 240 OHM 1/10W 5% 0402 SMD; Manufacturer: Yageo; Manufacturer Part Number: RC0402FR-07240RL; Resistance (Ohms): 240; Power (Watts): 0.063W, 1/16W; Temperature Coefficient: ±100ppm/°C; Supplier 1: Digi-Key; Supplier Part Number 1: 311-240LRDKR-ND; RoHS: RoHS Compliant; Category: Resistors; Stock 1: 39100; Pricing 1: 1=0.1, 10=0.014, 25=0.0104, 100=0.0063, 250=0.0054, 500=0.00382, 1000=0.0027, 2500=0.00234, 5000=0.00203 (USD); Composition: Thick Film; Features: -; Tolerance: ±1%; Package / Case: 0402 (1005 Metric); Supplier Device Package: 0402; Size / Dimension: 0.039" L x 0.020" W (1.00mm x 0.50mm); Height: 0.016" (0.40mm); Number of Terminations: 2; Packaging: Digi-Reel®; ComponentLink1URL: http://www.yageo.com/documents/recent/PYu-RC0402_51_RoHS_L_6.pdf; ComponentLink1Description: http://www.yageo.com/documents/recent/PYu-RC0402_51_RoHS_L_6.pdf
U? = MEM_DDR3L_MT41K256M16HA-125:E_FBGA: IC DDR3 SDRAM 4GBIT 800MHZ FBGA; Manufacturer: Micron Technology Inc.; Format - Memory: RAM; Memory Type: DDR3L SDRAM; Memory Size: 4G (256M x16); Interface: Parallel; Voltage - Supply: 1.283 V ~ 1.45 V; Supplier 1: Digi-Key; Manufacturer Part Number: MT41K256M16HA-125:E; RoHS: RoHS Compliant; Category: Integrated Circuits (ICs); Stock 1: 0; Pricing 1: 1000=0 (USD); Packaging: Tray; Part Status: Obsolete; Speed: 800MHz; Operating Temperature: 0°C ~ 95°C (TC); Package / Case: 96-TFBGA; Supplier Device Package: 96-FBGA (9x14); ComponentLink1URL: http://www.micron.com/~/media/Documents/Products/Data%20Sheet/DRAM/DDR3/4Gb_1_35V_DDR3L.pdf; ComponentLink1Description: http://www.micron.com/~/media/Documents/Products/Data%20Sheet/DRAM/DDR3/4Gb_1_35V_DDR3L.pdf; Supplier Part Number 1: MT41K256M16HA-125:E-ND

## Sheet [09] - ETHERNET.SchDoc
size A2; DocumentNumber: 9; SheetNumber: 9; SheetTotal: 13; NameAuthor: Angle Vu
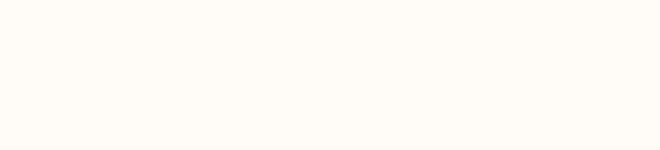
[diagram p10: [09] - ETHERNET.SchDoc]

### Notes on the sheet
- CLOCKS (CPU & PCIE)
- Designed By
- Checked By
- Page Name:
- Size:
- A2
- Company:
- Address:
- Sheet:
- /

## Sheet [10] - HDMI FRAMER.SchDoc
size A2; DocumentNumber: 10; SheetNumber: 10; SheetTotal: 13; NameAuthor: Angle Vu
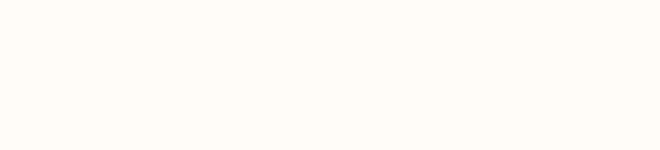
[diagram p11: [10] - HDMI FRAMER.SchDoc]

### Notes on the sheet
- CLOCKS (CPU & PCIE)
- Designed By
- Checked By
- Page Name:
- Size:
- A2
- Company:
- Address:
- Sheet:
- /

## Sheet [11] - EXP CONN, uSD.SchDoc
size A2; DocumentNumber: 11; SheetNumber: 11; SheetTotal: 13; NameAuthor: Angle Vu
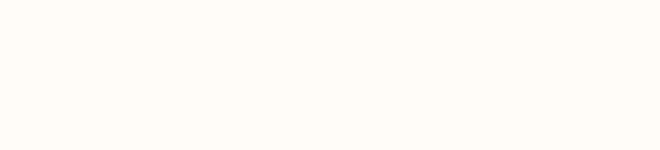
[diagram p12: [11] - EXP CONN, uSD.SchDoc]

### Notes on the sheet
- CLOCKS (CPU & PCIE)
- Designed By
- Checked By
- Page Name:
- Size:
- A2
- Company:
- Address:
- Sheet:
- /

## Sheet [12] - DOC REVISION HISTORY.SchDoc
size A2; DocumentNumber: 12; SheetNumber: 12; SheetTotal: 13; NameAuthor: Angle Vu
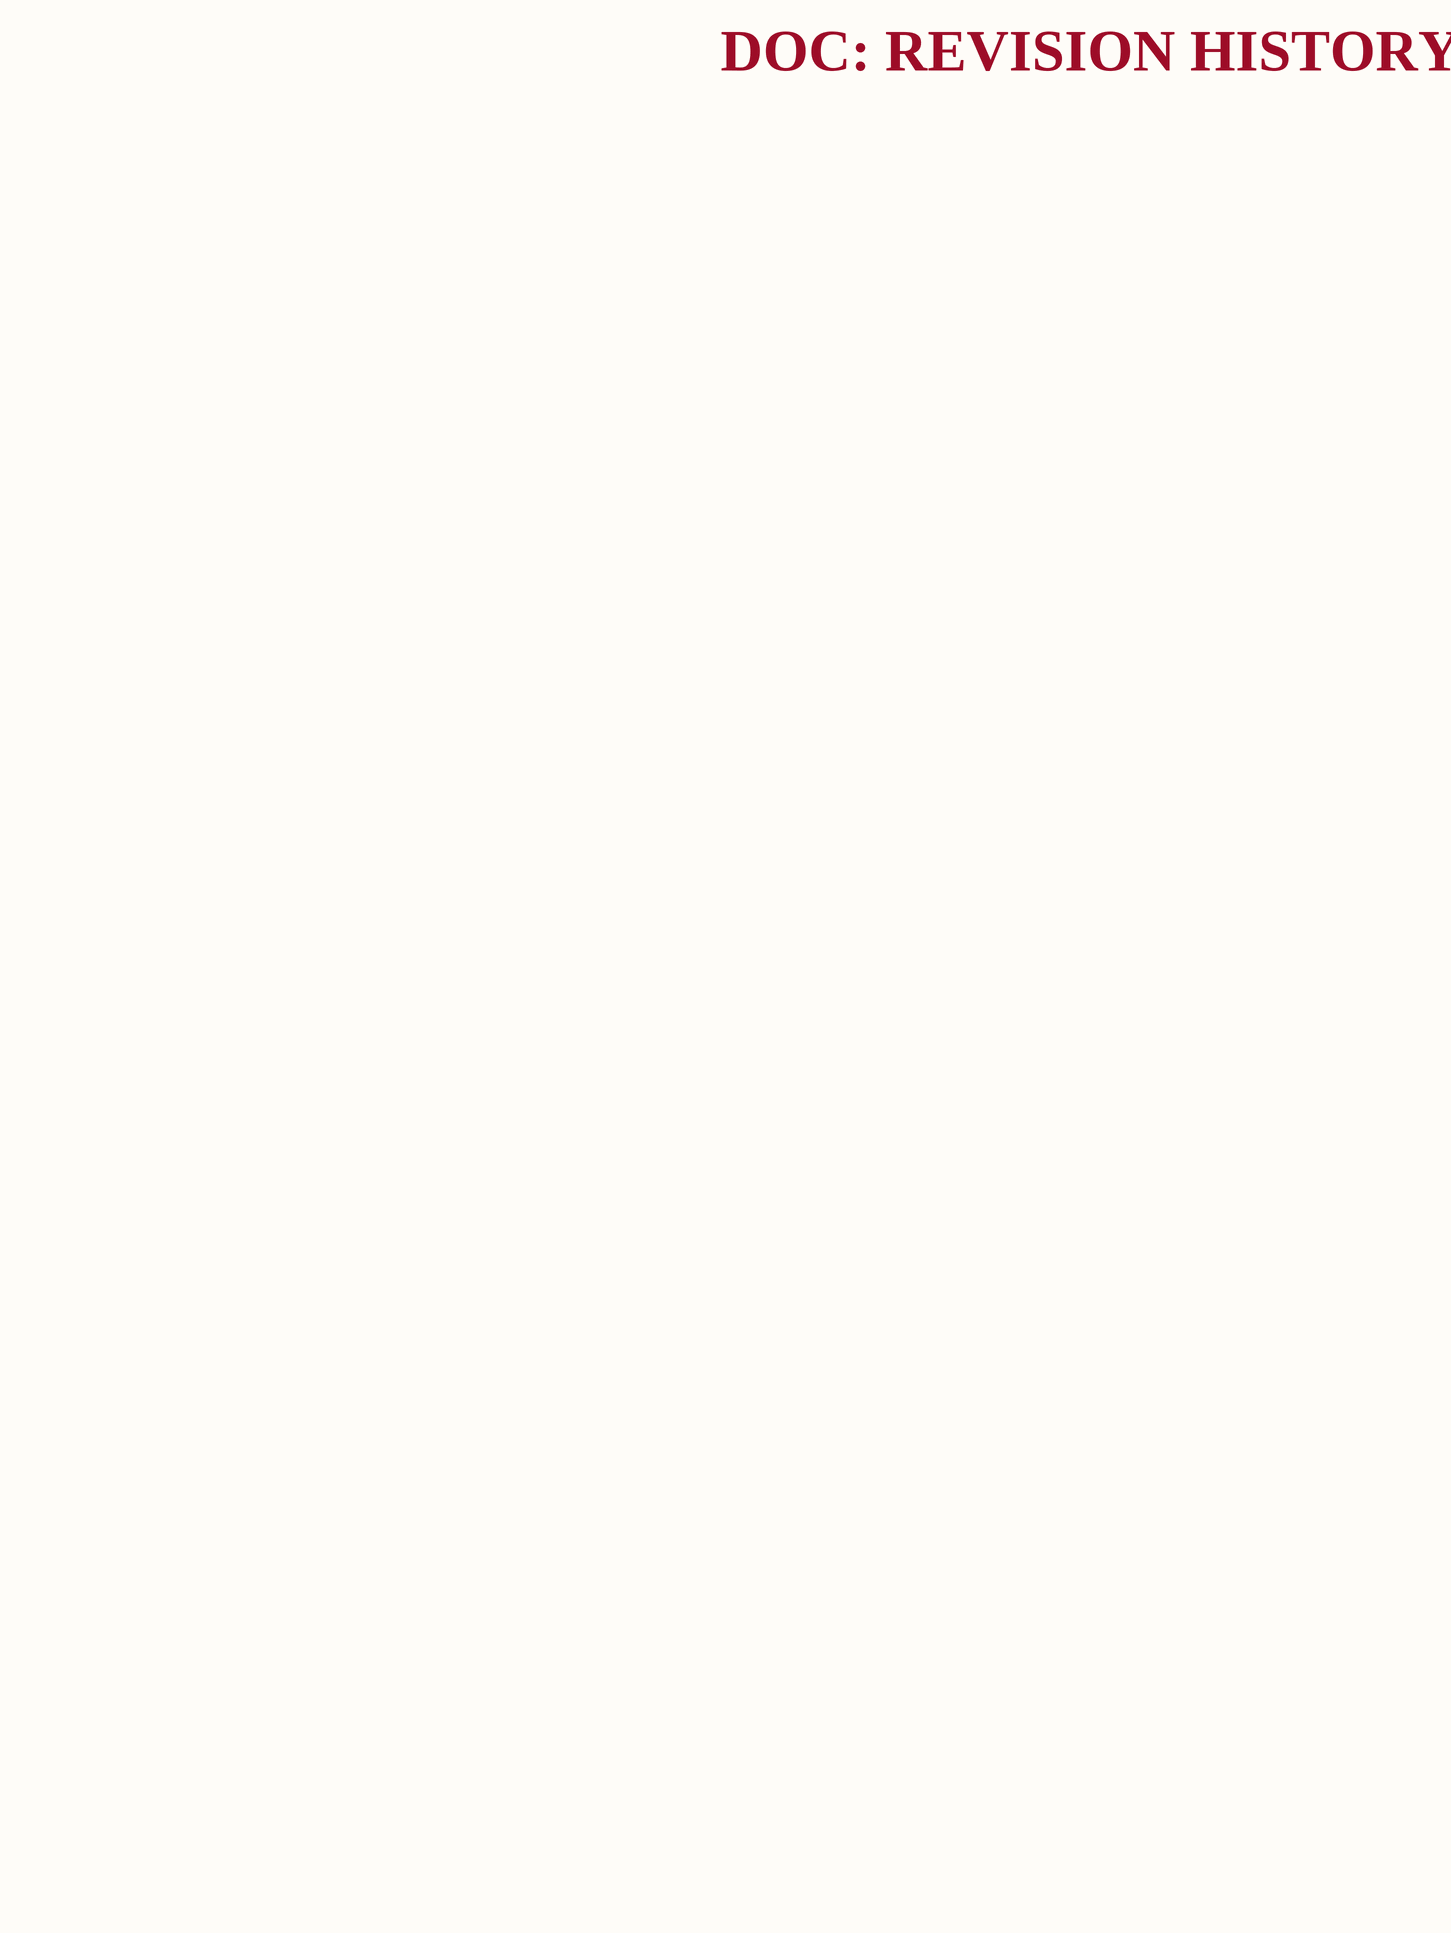
[diagram p13: [12] - DOC REVISION HISTORY.SchDoc]

### Notes on the sheet
- DOC: REVISION HISTORY
- CLOCKS (CPU & PCIE)
- Designed By
- Checked By
- Page Name:
- Size:
- A2
- Company:
- Address:
- Sheet:
- /